# Altium project EmSys_K70Wn_v1.PrjPCB (part 2 of 3)

## Sheet Sheet3.SchDoc
size A3; DocumentNumber: 3; SheetNumber: 3; SheetTotal: 7
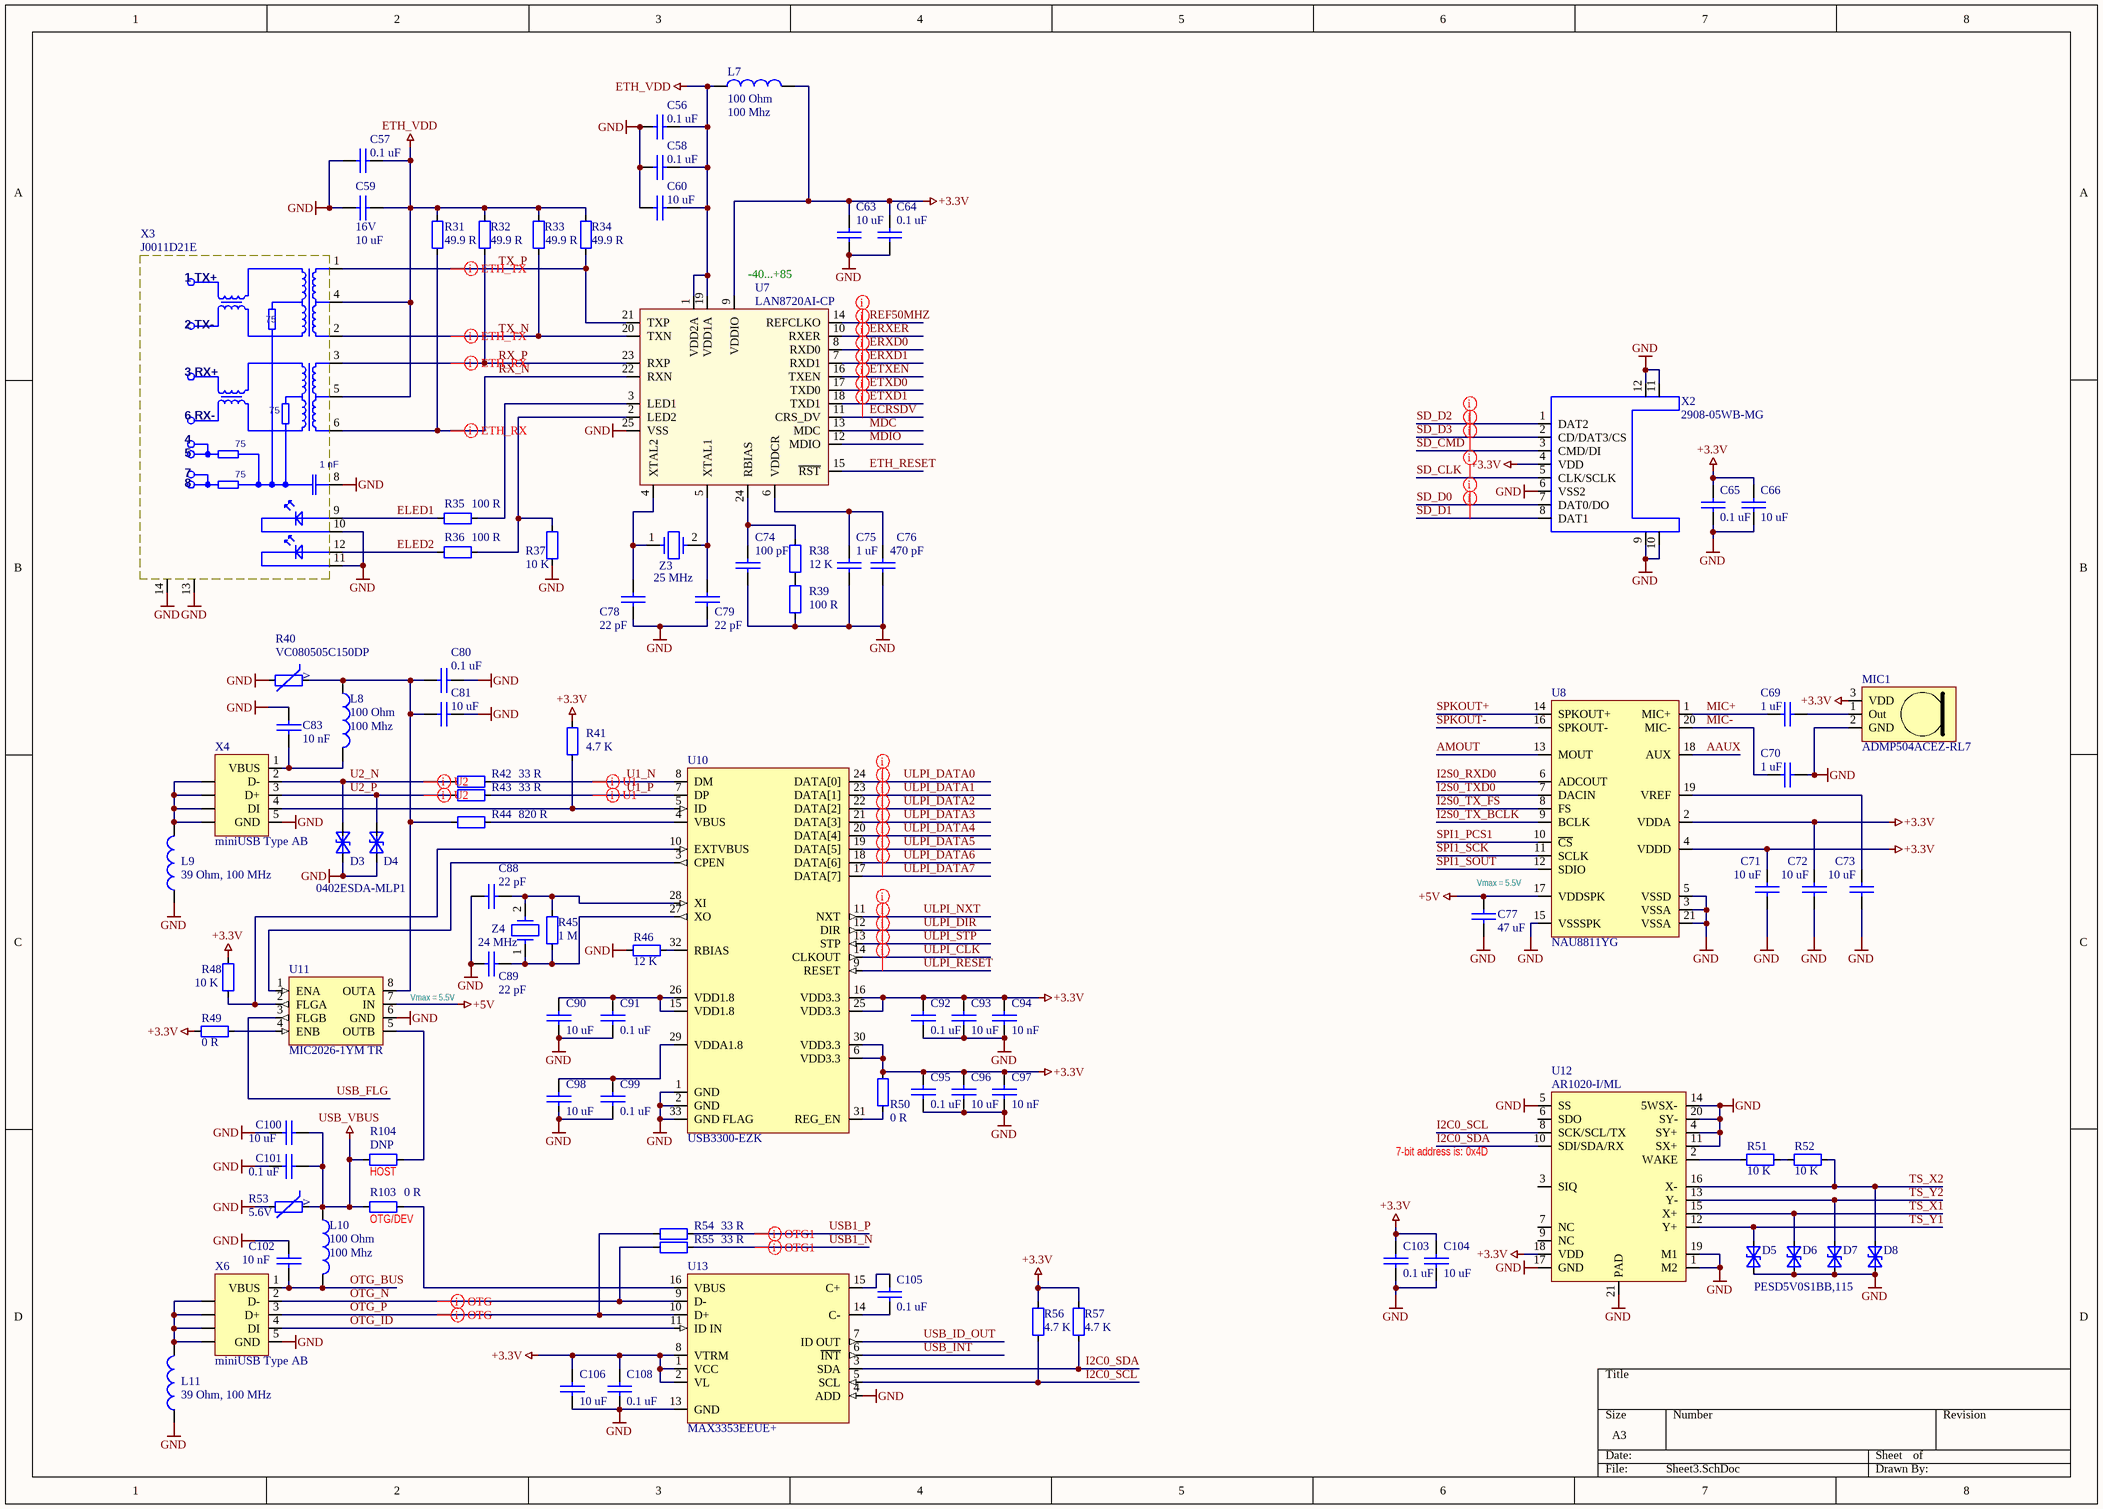
[diagram p2: Sheet3.SchDoc]

### Parts
C56  value 0.1 uF  [1608[0603]]  (hidden comment: CL10B104KA8NNND)
C57  value 0.1 uF  [1608[0603]]  (hidden comment: CL10B104KA8NNND)
C58  value 0.1 uF  [1608[0603]]  (hidden comment: CL10B104KA8NNND)
C59  value 10 uF  Voltage: 16V  [2012[0805]]  (hidden comment: C2012X5R1C106K085AC)
C60  value 10 uF  [2012[0805]]  (hidden comment: C2012X5R1C106K085AC)
C63  value 10 uF  [2012[0805]]  (hidden comment: C2012X5R1C106K085AC)
C64  value 0.1 uF  [1608[0603]]  (hidden comment: CL10B104KA8NNND)
C65  value 0.1 uF  [1608[0603]]  (hidden comment: CL10B104KA8NNND)
C66  value 10 uF  [2012[0805]]  (hidden comment: C2012X5R1C106K085AC)
C69  value 1 uF  [2012[0805]]  (hidden comment: GRM21BR71A105KA01L)
C70  value 1 uF  [2012[0805]]  (hidden comment: GRM21BR71A105KA01L)
C71  value 10 uF  [0805-1206]  (hidden comment: LMK212F106ZG-T)
C72  value 10 uF  [0805-1206]  (hidden comment: LMK212F106ZG-T)
C73  value 10 uF  [0805-1206]  (hidden comment: LMK212F106ZG-T)
C74  value 100 pF  [1608[0603]]  (hidden comment: CL10C101JB8NNNC)
C75  value 1 uF  [1608[0603]]  (hidden comment: CL10A105KO8NNNC)
C76  value 470 pF  [1608[0603]]  (hidden comment: CL10C471JB8NNNC)
C77  value 47 uF  [3225[1210]]  (hidden comment: GRM32ER71A476KE15L)
C78  value 22 pF  [1608[0603]]  (hidden comment: 0603N220J500CT)
C79  value 22 pF  [1608[0603]]  (hidden comment: 0603N220J500CT)
C80  value 0.1 uF  [1608[0603]]  (hidden comment: CL10B104KA8NNND)
C81  value 10 uF  [2012[0805]]  (hidden comment: C2012X5R1C106K085AC)
C83  value 10 nF  [1608[0603]]  (hidden comment: CL10B103JB8NNNC)
C88  value 22 pF  [1608[0603]]  (hidden comment: 0603N220J500CT)
C89  value 22 pF  [1608[0603]]  (hidden comment: 0603N220J500CT)
C90  value 10 uF  [2012[0805]]  (hidden comment: C2012X5R1C106K085AC)
C91  value 0.1 uF  [1608[0603]]  (hidden comment: CL10B104KA8NNND)
C92  value 0.1 uF  [1608[0603]]  (hidden comment: CL10B104KA8NNND)
C93  value 10 uF  [2012[0805]]  (hidden comment: C2012X5R1C106K085AC)
C94  value 10 nF  [1005[0402]]  (hidden comment: CL05B103KB5NNNC)
C95  value 0.1 uF  [1608[0603]]  (hidden comment: CL10B104KA8NNND)
C96  value 10 uF  [2012[0805]]  (hidden comment: C2012X5R1C106K085AC)
C97  value 10 nF  [1005[0402]]  (hidden comment: CL05B103KB5NNNC)
C98  value 10 uF  [2012[0805]]  (hidden comment: C2012X5R1C106K085AC)
C99  value 0.1 uF  [1608[0603]]  (hidden comment: CL10B104KA8NNND)
C100  value 10 uF  [2012[0805]]  (hidden comment: C2012X5R1C106K085AC)
C101  value 0.1 uF  [1608[0603]]  (hidden comment: CL10B104KA8NNND)
C102  value 10 nF  [1608[0603]]  (hidden comment: CL10B103JB8NNNC)
C103  value 0.1 uF  [1608[0603]]  (hidden comment: CL10B104KA8NNND)
C104  value 10 uF  [2012[0805]]  (hidden comment: C2012X5R1C106K085AC)
C105  value 0.1 uF  [1608[0603]]  (hidden comment: CL10B104KA8NNND)
C106  value 10 uF  [2012[0805]]  (hidden comment: C2012X5R1C106K085AC)
C108  value 0.1 uF  [1608[0603]]  (hidden comment: CL10B104KA8NNND)
D3  0402ESDA-MLP1  [0402]  (value not drawn)
D4  0402ESDA-MLP1  [0402]
D5  PESD5V0S1BB,115  [SOD523]
D6  PESD5V0S1BB,115  [SOD523]  (value not drawn)
D7  PESD5V0S1BB,115  [SOD523]  (value not drawn)
D8  PESD5V0S1BB,115  [SOD523]  (value not drawn)
L7  value 100 Ohm  Freq: 100 Mhz  [0603]  (hidden comment: MPZ1608D101B)
L8  value 100 Ohm  Freq: 100 Mhz  [0603]  (hidden comment: MPZ1608D101B)
L9  value 39 Ohm, 100 MHz  [0805]  (hidden comment: EXC-ML20A390U)
L10  value 100 Ohm  Freq: 100 Mhz  [0603]  (hidden comment: MPZ1608D101B)
L11  value 39 Ohm, 100 MHz  [0805]  (hidden comment: EXC-ML20A390U)
MIC1  ADMP504ACEZ-RL7  [ADMP504ACEZ]
R31  value 49.9 R  [0603]  (hidden comment: ERJ-3EKF49R9V)
R32  value 49.9 R  [0603]  (hidden comment: ERJ-3EKF49R9V)
R33  value 49.9 R  [0603]  (hidden comment: ERJ-3EKF49R9V)
R34  value 49.9 R  [0603]  (hidden comment: ERJ-3EKF49R9V)
R35  value 100 R  [0603]  (hidden comment: ERJ-3EKF1000V)
R36  value 100 R  [0603]  (hidden comment: ERJ-3EKF1000V)
R37  value 10 K  [0603]  (hidden comment: ERJ-3EKF1002V)
R38  value 12 K  [0603]  (hidden comment: RC0603FR-0712KL)
R39  value 100 R  [0603]  (hidden comment: ERJ-3EKF1000V)
R40  VC080505C150DP  [2012[0805]]
R41  value 4.7 K  [0603]  (hidden comment: RJ0603FRE074K7L)
R42  value 33 R  [0603]  (hidden comment: RC0603FR-0733RL)
R43  value 33 R  [0603]  (hidden comment: RC0603FR-0733RL)
R44  value 820 R  [0603]  (hidden comment: RC0603FR-07820RL)
R45  value 1 M  [0603]  (hidden comment: RC0603FR-071ML)
R46  value 12 K  [0603]  (hidden comment: RC0603FR-0712KL)
R48  value 10 K  [0603]  (hidden comment: ERJ-3EKF1002V)
R49  value 0 R  [0603]  (hidden comment: RC0603JR-070RL)
R50  value 0 R  [0603]  (hidden comment: RC0603JR-070RL)
R51  value 10 K  [0603]  (hidden comment: ERJ-3EKF1002V)
R52  value 10 K  [0603]  (hidden comment: ERJ-3EKF1002V)
R53  Voltage: 5.6V  [2012[0805]]  (hidden comment: VC080505C150DP)
R54  value 33 R  [0603]  (hidden comment: RC0603FR-0733RL)
R55  value 33 R  [0603]  (hidden comment: RC0603FR-0733RL)
R56  value 4.7 K  [0603]  (hidden comment: RJ0603FRE074K7L)
R57  value 4.7 K  [0603]  (hidden comment: RJ0603FRE074K7L)
R103  value 0 R  [0603]  (hidden comment: RC0603JR-070RL)
R104  value DNP  [0603]  (hidden comment: DNP_0603)  (no BOM)
U7  LAN8720AI-CP  [THIN QFN 24]
U8  NAU8811YG  [THIN QFN 20 W/O VIA]
U10  USB3300-EZK  [HVQFN32 NXP]
U11  MIC2026-1YM TR  [SO-8]
U12  AR1020-I/ML  [THIN QFN 20 W/O VIA]
U13  MAX3353EEUE+  [TSOP65P640-16AM]
X2  2908-05WB-MG  [2908-05WB-MG]
X3  J0011D21E  [PulseJack_J00]
X4  miniUSB Type AB  [USB AB 56579-0576 Molex]
X6  miniUSB Type AB  [USB AB 56579-0576 Molex]
Z3  value 25 MHz  [ABM3]  (hidden comment: ABM3-25.000MHZ-B2-T)
Z4  value 24 MHz  [ABM3]  (hidden comment: ABM3-24.000MHZ-B2-T)

### Nets
+3.3V: C63.2 C64.2 C65.1 C66.1 C71.2 C72.2 C92.2 C93.1 C94.2 C95.2 C96.1 C97.2 C103.1 C104.1 C106.2 C108.1 L7.2 MIC1.3(VDD) R41.2 R48.1 R49.2 R50.2 R56.2 R57.2 U7.9(VDDIO) U8.2(VDDA) U8.4(VDDD) U10.6(VDD3.3) U10.16(VDD3.3) U10.25(VDD3.3) U10.30(VDD3.3) U12.18(VDD) U13.1(VCC) U13.2(VL) U13.8(VTRM) X2.4(VDD)
+5V: C77.1 U8.17(VDDSPK) U11.7(IN)
ETH_VDD: C56.1 C57.1 C58.1 C59.1 C60.1 L7.1 R31.2 R32.2 R33.1 R34.1 U7.1(VDD2A) U7.19(VDD1A) X3.4(CT) X3.5(CT)
GND: C56.2 C57.2 C58.2 C59.2 C60.2 C63.1 C64.1 C65.2 C66.2 C70.2 C71.1 C72.1 C73.1 C74.2 C75.1 C76.2 C77.2 C78.2 C79.2 C80.2 C81.1 C83.2 C88.1 C89.1 C90.1 C91.2 C92.1 C93.2 C94.1 C95.1 C96.2 C97.1 C98.1 C99.2 C100.1 C101.2 C102.2 C103.2 C104.2 C106.1 C108.2 D3.1(C) D4.1(C) D5.2(A) D6.2(A) D7.2(A) D8.2(A) L9.1 L11.1 MIC1.2(GND) R37.2 R39.1 R40.1 R46.1 R53.1 U7.25(VSS) U8.3(VSSA) U8.5(VSSD) U8.15(VSSSPK) U8.21(VSSA) U10.1(GND) U10.2(GND) U10.33(GND_FLAG) U11.6(GND) U12.1(M2) U12.4(SY+) U12.5(SS) U12.11(SX+) U12.14(5WSX-) U12.17(GND) U12.19(M1) U12.20(SY-) U12.21(PAD) U13.4(ADD) U13.13(GND) X2.6(VSS2) X2.9 X2.10(WP) X2.11(GND) X2.12(GND) X3.8(GND) X3.10 X3.11 X3.13 X3.14 X4.5(GND) X6.5(GND)
USB_VBUS: C100.2 C101.1 L10.1 R53.2 R103.2 R104.1
AAUX: U8.18(AUX)
AMOUT: U8.13(MOUT)
ECRSDV: U7.11(CRS_DV)
ELED1: R35.1 X3.9
ELED2: R36.1 X3.12
ERXD0: U7.8(RXD0)
ERXD1: U7.7(RXD1)
ERXER: U7.10(RXER)
ETH_RESET: U7.15(~{RST})
ETXD0: U7.17(TXD0)
ETXD1: U7.18(TXD1)
ETXEN: U7.16(TXEN)
I2C0_SCL: R56.1 U12.8(SCK/SCL/TX) U13.5(SCL)
I2C0_SDA: R57.1 U12.10(SDI/SDA/RX) U13.3(SDA)
I2S0_RXD0: U8.6(ADCOUT)
I2S0_TX_BCLK: U8.9(BCLK)
I2S0_TX_FS: U8.8(FS)
I2S0_TXD0: U8.7(DACIN)
MDC: U7.13(MDC)
MDIO: U7.12(MDIO)
MIC+: C69.1 U8.1(MIC+)
MIC-: C70.1 U8.20(MIC-)
OTG_BUS: C102.1 L10.2 X6.1(VBUS)
OTG_ID: U13.11(ID_IN) X6.4(DI)
OTG_N: R55.1 U13.9(D-) X6.2(D-)
OTG_P: R54.1 U13.10(D+) X6.3(D+)
REF50MHZ: U7.14(REFCLKO)
RX_N: R31.1 U7.22(RXN) X3.6(RD-)
RX_P: R32.1 U7.23(RXP) X3.3(RD+)
SD_CLK: X2.5(CLK/SCLK)
SD_CMD: X2.3(CMD/DI)
SD_D0: X2.7(DAT0/DO)
SD_D1: X2.8(DAT1)
SD_D2: X2.1(DAT2)
SD_D3: X2.2(CD/DAT3/CS)
SPI1_PCS1: U8.10(~{CS})
SPI1_SCK: U8.11(SCLK)
SPI1_SOUT: U8.12(SDIO)
SPKOUT+: U8.14(SPKOUT+)
SPKOUT-: U8.16(SPKOUT-)
TS_X1: D6.1(C) U12.15(X+)
TS_X2: D8.1(C) R52.2 U12.16(X-)
TS_Y1: D5.1(C) U12.12(Y+)
TS_Y2: D7.1(C) U12.13(Y-)
TX_N: R33.2 U7.20(TXN) X3.2(TD-)
TX_P: R34.2 U7.21(TXP) X3.1(TD+)
U1_N: R42.2 U10.8(DM)
U1_P: R43.2 U10.7(DP)
U2_N: D3.2(A) R42.1 X4.2(D-)
U2_P: D4.2(A) R43.1 X4.3(D+)
ULPI_CLK: U10.14(CLKOUT)
ULPI_DATA0: U10.24(DATA[0])
ULPI_DATA1: U10.23(DATA[1])
ULPI_DATA2: U10.22(DATA[2])
ULPI_DATA3: U10.21(DATA[3])
ULPI_DATA4: U10.20(DATA[4])
ULPI_DATA5: U10.19(DATA[5])
ULPI_DATA6: U10.18(DATA[6])
ULPI_DATA7: U10.17(DATA[7])
ULPI_DIR: U10.12(DIR)
ULPI_NXT: U10.11(NXT)
ULPI_RESET: U10.9(RESET)
ULPI_STP: U10.13(STP)
USB1_N: R55.2
USB1_P: R54.2
USB_FLG: U11.3(FLGB)
USB_ID_OUT: U13.7(ID_OUT)
USB_INT: U13.6(~{INT})
NetC69_2: C69.2 MIC1.1(Out)
NetC73_2: C73.2 U8.19(VREF)
NetC74_1: C74.1 R38.2 U7.24(RBIAS)
NetC75_2: C75.2 C76.1 U7.6(VDDCR)
NetC78_1: C78.1 U7.4(XTAL2) Z3.1
NetC79_1: C79.1 U7.5(XTAL1) Z3.2
NetC80_1: C80.1 C81.2 L8.1 R40.2 R44.1 U11.8(OUTA)
NetC83_1: C83.1 L8.2 X4.1(VBUS)
NetC88_2: C88.2 R45.2 U10.28(XI) Z4.2
NetC89_2: C89.2 R45.1 U10.27(XO) Z4.1
NetC90_2: C90.2 C91.1 U10.15(VDD1.8) U10.26(VDD1.8)
NetC98_2: C98.2 C99.1 U10.29(VDDA1.8)
NetC105_1: C105.1 U13.15(C+)
NetC105_2: C105.2 U13.14(C-)
NetL9_2: L9.2 X4.S1(SHLD) X4.S2(SHLD) X4.S3(SHLD) X4.S4(SHLD)
NetL11_2: L11.2 X6.S1(SHLD) X6.S2(SHLD) X6.S3(SHLD) X6.S4(SHLD)
NetR35_2: R35.2 U7.3(LED1)
NetR36_2: R36.2 R37.1 U7.2(LED2)
NetR38_1: R38.1 R39.2
NetR41_1: R41.1 U10.5(ID) X4.4(DI)
NetR44_2: R44.2 U10.4(VBUS)
NetR46_2: R46.2 U10.32(RBIAS)
NetR48_2: R48.2 U10.10(EXTVBUS) U11.2(FLGA)
NetR49_1: R49.1 U11.4(ENB)
NetR50_1: R50.1 U10.31(REG_EN)
NetR51_1: R51.1 U12.2(WAKE)
NetR51_2: R51.2 R52.1
NetR103_1: R103.1 U13.16(VBUS)
NetR104_2: R104.2 U11.5(OUTB)
NetU10_3: U10.3(CPEN) U11.1(ENA)

Not connected (* = marked no-connect by the designer): U12 3(SIQ) 6(SDO) 7(NC) 9(NC)

### Layout directives
net class ETHERNET: ECRSDV, ERXD0, ERXD1, ERXER, ETXD0, ETXD1, ETXEN, REF50MHZ
net class SD_CARD: SD_CLK, SD_CMD, SD_D0, SD_D1, SD_D2, SD_D3
net class ULPI_DATA: ULPI_DATA0, ULPI_DATA1, ULPI_DATA2, ULPI_DATA3, ULPI_DATA4, ULPI_DATA5, ULPI_DATA6, ULPI_DATA7
net class ULPI_CTRL: ULPI_CLK, ULPI_DIR, ULPI_NXT, ULPI_RESET, ULPI_STP
differential pair: OTG_N, OTG_P, RX_N, RX_P, TX_N, TX_P, U1_N, U1_P, U2_N, U2_P, USB1_N, USB1_P

### Notes on the sheet
- (near U7) -40...+85
- Vmax = 5.5V
- (near R104) HOST
- (near U12) 7-bit address is: 0x4D
- (near R103) OTG/DEV
- (in symbol J0011D21E) 1 TX+; 2 TX-; 75; 3 RX+; 6 RX-; 1 nF; 7
- (in symbol VC080505C150D) V

### Library data of the parts
C56-C58 C64 C65 C80 C91 C92 C95 C99 C101 C103 C105 C108 = CVNF100K0603-25: as C51 on sheet Sheet2; Tolerance: 10%; Distributor: Future; Price: 0.0026 Euro; Voltage: 25 V; PartNum: CL10B104KA8NNND; PartName: CL10B104KA8NNND; Price50: 0.0026 Euro; Price100: 0.0026 Euro; Price1000: 0.0026 Euro
C59 C60 C63 C66 C81 C90 C93 C96 C98 C100 C104 C106 = C2012X5R1C106K/0.85: 10 uF, 16V, X5R, ±10%, 0805; Manufacturer: TDK Corporation; Distributor: Future; Price: 0.0347 Euro; Tolerance: ±10%; PartNum: C2012X5R1C106K085AC; PartName: C2012X5R1C106K085AC; Price50: 0.0347 Euro; Price100: 0.0347 Euro; Price1000: 0.0347 Euro
  C60 C63 C66 C81 C90 C93 C96 C98 C100 C104 C106: Voltage: 16V
C69 C70 = GRM21BR71A105KA01L: 1 uF, 10V, 10%, X7R, 0805; Manufacturer: Murata; PartNum: 311-1458-1-ND; PartName: CC0805KKX7R6BB105; Tolerance: 10%; Price: 0.02$; Distributor: Mouser; Voltage: 10 V
C71-C73 = LMK212F106ZG-T: 10 uF, 10V, Y5V, -20%.. +80%, 0805; Manufacturer: Taiyo Yuden; PartNum: 587-1312-6-ND; Distributor: Digi-Key; Price: 0.11$; Tolerance: 20%.. +80%; Voltage: 10V; PartName: LMK212F106ZG-T
C74 = CCPF100K0603: 100 pF, 50V, 5%, NP0, 0603 SMD MLC Capacitor; Manufacturer: SAMSUNG; Tolerance: 5%; Price: 0.003$; Distributor: Future; PartNum: CL10C101JB8NNNC; Voltage: 50 V; PartName: CL10C101JB8NNNC; Price50: 0.003$; Price100: 0.003$; Price1000: 0.003$
C75 = GRM188R60J105KA01D: 1.0 uF, 16V, 10%, X5R, 0603; Manufacturer: SAMSUNG; Tolerance: 10%; Distributor: Future; Price: 0.0037 Euro; PartNum: CL10A105KO8NNNC; Voltage: 16 V; PartName: CL10A105KO8NNNC; Price50: 0.0037 Euro; Price100: 0.0037 Euro; Price1000: 0.0037 Euro
C76 = 06035A471JAT2A: 470 pF, 50V, 5%, C0G, NP0, -55°C ~ 125°C,0603 SMD MLC Capacitor; Manufacturer: SAMSUNG; Tolerance: 5%; Price: 0.003$; Distributor: Future; PartNum: CL10C471JB8NNNC; Voltage: 50 V; PartName: CL10C471JB8NNNC; Price50: 0.003$; Price100: 0.003$; Price1000: 0.003$
C77 = GRM32ER71A476KE15L: 47.0 uF, 10V, 10%, X7R, 1210; Manufacturer: Murata Electronics North America; PartNum: 490-5312-2-ND; Tolerance: 10%; Price: 3.3; Distributor: Digi-Key; Voltage: 10V; PartName: GRM32ER71A476KE15L
C78 C79 C88 C89 = CCPF022K0603: 22 pF, 50V, 5%, NP0, 0603 SMD MLC Capacitor; Manufacturer: WLS; Tolerance: 5%; Price: 0.0017$; Distributor: Future; PartNum: 0603N220J500CT; Voltage: 50 V; PartName: 0603N220J500CT; Price50: 0.0017$; Price100: 0.0017$; Price1000: 0.0017$
C83 C102 = CVNF010K0603: 10 nF, 50V, 5%, X7R, 0603 SMD MLC Capacitor; Manufacturer: SAMSUNG; Tolerance: 5%; Distributor: Future; Price: 0.0045 Euro; PartNum: CL10B103JB8NNNC; Voltage: 50 V; PartName: CL10B103JB8NNNC; Price50: 0.0045 Euro; Price100: 0.0045 Euro; Price1000: 0.0045 Euro
C94 C97 = GRM155R71C103KA01D: 10 nF, 16V, 10%, X7R, 0402; Manufacturer: SAMSUNG; Tolerance: 10%; Distributor: Future; Price: 0.02$; PartNum: CL05B103KB5NNNC; Voltage: 16 V; PartName: CL05B103KB5NNNC; Price50: 0.006$; Price100: 0.004$; Price1000: 0.003$
D3 D4 = 0402ESDA-MLP1: SUPPRESSOR ESD 30VDC 0402 HFREE; Manufacturer: Cooper Bussmann; PartNum: 283-2964-2-ND; Voltage: 30V; Distributor: Digi-Key; Price: 0.087$; PartName: 0402ESDA-MLP1
D5-D8 = PESD5V0S1BB,115: TVS DIODE 5VWM 14VC SOD523; Manufacturer: NXP Semiconductors; PartNum: 568-4054-2-ND; Voltage: 5V; Distributor: Digi-Key; Price: 0.1$; PartName: PESD5V0S1BB,115
L7 L8 L10 = MPZ1608D101B: FERRITE CHIP 100 OHM 1A 0603; Manufacturer: TDK Corporation; PartNum: 445-2988-2-ND; Distributor: Digi-Key; Price: 0.02$; PartName: MPZ1608D101B
L9 L11 = EXC-ML20A390U: Ferrite bead, 39 Ohm, 100 MHz,  4 A; Manufacturer: Panasonic - ECG; PartNum: P10191TR-ND; Ordered: Digi-Key; Distributor: Digi-Key; Price: 0.21$; PartName: EXC-ML20A390U; Price50: 0.17$; Price100: 0.15$; Price1000: 0.1$
MIC1 = ADMP504ACEZ-RL7: Mems Omni  -38dB ,  100Hz-20kHz, 200Ohm, 2 V, 65dB s/n, 225 uA; Manufacturer: Analog Devices Inc; PartNum: ADMP504ACEZ-RL7CT-ND; Distributor: DigiKey; Price: 4.52$; PartName: ADMP504ACEZ-RL7CT-ND
R31-R34 = CRCW060349R9FKEA: 49.9 R, 1%, 0.1 W, 0603, SMD Resistor, Taped; Manufacturer: PANASONIC; Voltage: 75 V; Distributor: Future; Price: 0.0015 Euro; Tolerance: 1%; PartNum: ERJ-3EKF49R9V; PartName: ERJ-3EKF49R9V; Price50: 0.0015 Euro; Price100: 0.0015 Euro; Price1000: 0.0015 Euro
R35 R36 R39 = RL0603E100-1: 100 R, 1%, 0603, SMD Resistor, Taped; Manufacturer: PANASONIC; Voltage: 75 V; Distributor: Future; Price: 0.0017$; Tolerance: 1%; PartNum: ERJ-3EKF1000V; PartName: ERJ-3EKF1000V; Price50: 0.0015 Euro; Price100: 0.0015 Euro; Price1000: 0.0015 Euro
R37 R48 R51 R52 = RL0603K010-1: as R21 on sheet Sheet2; Distributor: Future; Price: 0.0015 Euro; Tolerance: 1%; PartNum: ERJ-3EKF1002V; PartName: ERJ-3EKF1002V; Price50: 0.0015 Euro; Price100: 0.0015 Euro; Price1000: 0.0015 Euro
R38 = RL0603K012-1: 12 K, 1%, 0603, SMD Resistor, Taped; Manufacturer: YAGEO AMERICA CORPORATION; Voltage: 75 V; Distributor: Farnell; Price: 0.0017$; Tolerance: 1%; PartNum: RC0603FR-0712KL; PartName: RC0603FR-0712KL; Price50: 0.0017$; Price100: 0.0017$; Price1000: 0.0017$
R40 = VC080505C150D: TVS, volt 5.6 V, Clamping voltage 18 V; Manufacturer: AVX Corporation; PartNum: 478-2507-1-ND; Voltage: 5.6V; Ordered: Digi-Key; Price: 0.81$; Distributor: Digi-Key; PartName: VC080505C150DP; Price50: 0.4$; Price100: 0.47$; Price1000: 0.38$
R41 R56 R57 = RL0603K004.7-1_1: 4.7 K, 1%, 0603, SMD Resistor, Taped; Manufacturer: YAGEO AMERICA CORPORATION; Voltage: 75 V; Distributor: Future; Price: 0.0017$; Tolerance: 1%; PartNum: RJ0603FRE074K7L; PartName: RJ0603FRE074K7L; Price50: 0.0017$; Price100: 0.0017$; Price1000: 0.0017$
R42 R43 R54 R55 = RL0603E033-1: 33 R, 1%, 0603, SMD Resistor, Taped; Manufacturer: YAGEO AMERICA CORPORATION; Voltage: 75 V; Distributor: Future; Price: 0.0017$; Tolerance: 1%; PartNum: RC0603FR-0733RL; PartName: RC0603FR-0733RL; Price50: 0.0017$; Price100: 0.0017$; Price1000: 0.0017$
R44 = RC0603FR-07820RL: 820 R, 1%, 0603, SMD Resistor, Taped; Manufacturer: YAGEO AMERICA CORPORATION; PartNum: 311-820HRTR-ND; Voltage: 75 V; Distributor: Digi-Key; Price: 0.0017$; Tolerance: 1%; PartName: RC0603FR-07820RL; Price50: 0.0017$; Price100: 0.0017$; Price1000: 0.0017$
R45 = RC0603FR-071ML: as R1 on sheet Sheet1; Distributor: Future; Price: 0.002 Euro; Tolerance: 1%; PartNum: RC0603FR-071ML; PartName: RC0603FR-071ML
R46 = RL0603K012-1_1: 12 K, 1%, 0603, SMD Resistor, Taped; Manufacturer: YAGEO AMERICA CORPORATION; Voltage: 75 V; Distributor: Farnell; Price: 0.0017$; Tolerance: 1%; PartNum: RC0603FR-0712KL; PartName: RC0603FR-0712KL; Price50: 0.0017$; Price100: 0.0017$; Price1000: 0.0017$
R49 R50 R103 = RL0603E000: as R20 on sheet Sheet2; Distributor: Future; Price: 0.0017$; Tolerance: 5%; PartNum: RC0603JR-070RL; PartName: RC0603JR-070RL; Price50: 0.0017$; Price100: 0.0017$; Price1000: 0.0017$
R53 = VC080505C150D: TVS, volt 5.6 V, Clamping voltage 18 V; Manufacturer: AVX Corporation; PartNum: 478-2507-1-ND; Ordered: Digi-Key; Price: 0.81$; Distributor: Digi-Key; PartName: VC080505C150DP; Price50: 0.4$; Price100: 0.47$; Price1000: 0.38$
R104 = DNP_0603: DNP, 0603
U7 = LAN8720AI-CP: TXRX PHY 10/100 1.6...3.6V, -40..85 C, 24-QFN; Manufacturer: Micrel Inc; PartNum: 886-LAN8720AI-CP; Ordered: Mouser; Distributor: Mouser; Price: 1.34 Euro; PartName: LAN8720AI-CP; Price50: 1.25 Euro; Price100: 0.98 Euro; Price1000: 0.86 Euro
U8 = NAU8811YG: Audio CODEC, Mono, Speaker Driver, QFN-20; Manufacturer: Nuvoton Technology; PartNum: NAU8811YG-ND; Distributor: Digi-Key; Price: 2.4$; PartName: NAU8811YG
U10 = USB3300-EZK: IC USB HOST/OTG PHY ULPI 32-QFN; Manufacturer: Microchip Technology; PartNum: 638-1034-ND; Distributor: DigiKey; Price: 1.24$; PartName: USB3300-EZK
U11 = MIC2026-1YM TR: Dual-Channel Power Distribution Switch, 8 Lead SOIC; Manufacturer: Micrel; PartNum: 576-1059-1-ND; Ordered: Future; Price: 0.59 Euro; Distributor: Future; PartName: MIC2026-1YM TR; Price50: 0.57 Euro; Price100: 0.76$; Price1000: 0.53$
U12 = AR1020-I/ML: IC TOUCH SCREEN CTRLR 20-QFN; Manufacturer: Microchip Technology; PartNum: AR1020-I/ML-ND; Distributor: DigiKey; Price: 2.3$; PartName: AR1020-I/ML
U13 = MAX3353EEUE+: IC CHARGE PUMP USB OTG 16TSSOP; Manufacturer: Maxim Integrated; PartNum: MAX3353EEUE+-ND; Distributor: DigiKey; Price: 2.82$; PartName: MAX3353EEUE+
X2 = 2908-05WB-MG: microSD cadr holder; Manufacturer: Amphenol Commercial Products; PartNum: 101-00660-68-6-1-ND; PartName: 101-00660-68-6; Ordered: Digi-Key; Price: 1.97$; Distributor: Digi-Key; Price50: 1.44$; Price100: 1.29$; Price1000: 1.06$
X3 = J0011D21E: 10/100 Base-TX RJ45 1x1 with LEDs 8-pin (J0 series); Manufacturer: Pulse; PartNum: 673-J0011D21E; Price: 3.74 $; Distributor: Mouser
X4 X6 = USB AB 56579-0576: SMD USB - OTG, miniUSB Type AB; Manufacturer: Molex/Waldom Electronics Corp; PartNum: WM17122CT-ND; Ordered: Digi-Key; Distributor: Digi-Key; Price: 2.81$; PartName: miniUSB Type AB; Price50: 2.43$; Price100: 1.83$; Price1000: 1.62$
Z3 = ABM3-25.000MHZ-B2-T: 25 MHz, 18 pF, 30 Ohm, ±50ppm, -20°C ~ 70°C; Manufacturer: Abracon Corporation; PartNum: 535-9108-1-ND; Price: 1$; Distributor: Digi-Key; Tolerance: 50 ppm; PartName: ABM3-25.000MHZ-B2-T
Z4 = ABM3-24.000MHZ-B2-T: 24 MHz, 18 pF, 30 Ohm, ±50ppm, -20°C ~ 70°C; Manufacturer: Abracon Corporation; PartNum: 535-9106-1-ND; Price: 1$; Distributor: Digi-Key; Tolerance: 50 ppm; PartName: ABM3-24.000MHZ-B2-T

## Sheet Sheet4.SchDoc
size A3; DocumentNumber: 4; SheetNumber: 4; SheetTotal: 7
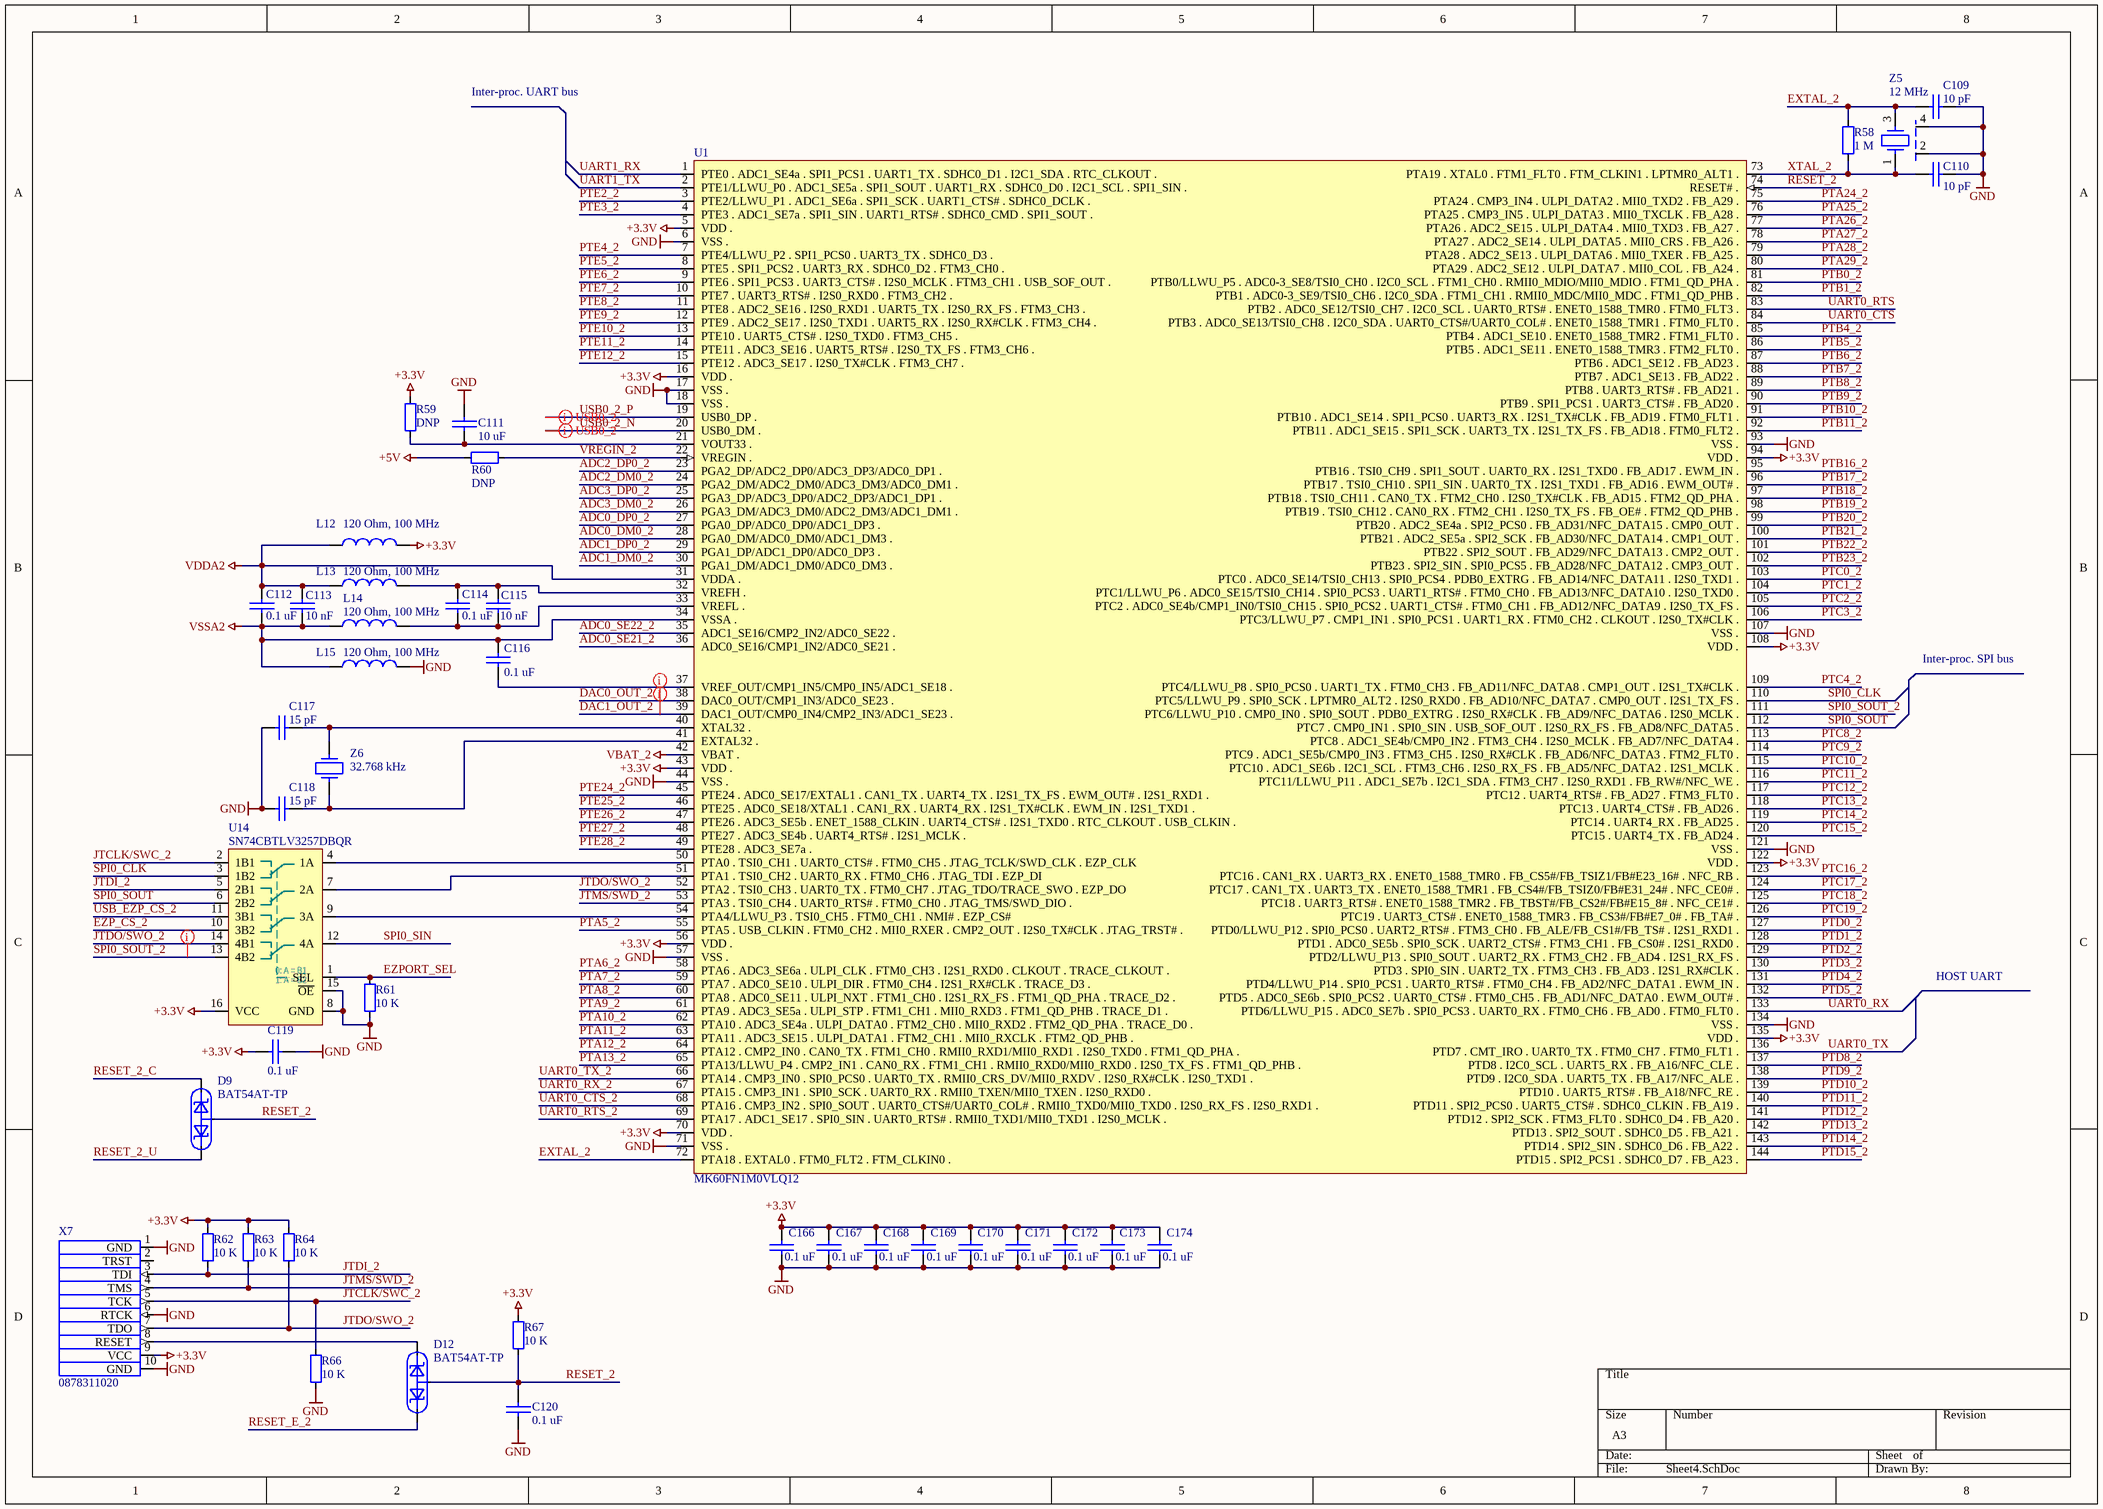
[diagram p3: Sheet4.SchDoc]

### Parts
C109  value 10 pF  [1608[0603]]  (hidden comment: CCPF010K0603)
C110  value 10 pF  [1608[0603]]  (hidden comment: CCPF010K0603)
C111  value 10 uF  [2012[0805]]  (hidden comment: C2012X5R1C106K085AC)
C112  value 0.1 uF  [1005[0402]]  (hidden comment: CL10B104KA8NNND)
C113  value 10 nF  [1005[0402]]  (hidden comment: CL05B103KB5NNNC)
C114  value 0.1 uF  [1005[0402]]  (hidden comment: CL10B104KA8NNND)
C115  value 10 nF  [1005[0402]]  (hidden comment: CL05B103KB5NNNC)
C116  value 0.1 uF  [1608[0603]]  (hidden comment: CL10B104KA8NNND)
C117  value 15 pF  [1608[0603]]  (hidden comment: CC0603JRNPO9BN150)
C118  value 15 pF  [1608[0603]]  (hidden comment: CC0603JRNPO9BN150)
C119  value 0.1 uF  [1005[0402]]  (hidden comment: CL10B104KA8NNND)
C120  value 0.1 uF  [1005[0402]]  (hidden comment: CL10B104KA8NNND)
C166  value 0.1 uF  [1005[0402]]  (hidden comment: CL10B104KA8NNND)
C167  value 0.1 uF  [1005[0402]]  (hidden comment: CL10B104KA8NNND)
C168  value 0.1 uF  [1005[0402]]  (hidden comment: CL10B104KA8NNND)
C169  value 0.1 uF  [1005[0402]]  (hidden comment: CL10B104KA8NNND)
C170  value 0.1 uF  [1005[0402]]  (hidden comment: CL10B104KA8NNND)
C171  value 0.1 uF  [1005[0402]]  (hidden comment: CL10B104KA8NNND)
C172  value 0.1 uF  [1005[0402]]  (hidden comment: CL10B104KA8NNND)
C173  value 0.1 uF  [1005[0402]]  (hidden comment: CL10B104KA8NNND)
C174  value 0.1 uF  [1005[0402]]  (hidden comment: CL10B104KA8NNND)
D9  BAT54AT-TP  [SOT-523F]
D12  BAT54AT-TP  [SOT-523F]
L12  value 120 Ohm, 100 MHz  [1005[0402]]  (hidden comment: MPZ1005S121C)
L13  value 120 Ohm, 100 MHz  [1005[0402]]  (hidden comment: MPZ1005S121C)
L14  value 120 Ohm, 100 MHz  [1005[0402]]  (hidden comment: MPZ1005S121C)
L15  value 120 Ohm, 100 MHz  [1005[0402]]  (hidden comment: MPZ1005S121C)
R58  value 1 M  [0603]  (hidden comment: RC0603FR-071ML)
R59  value DNP  [0603]  (hidden comment: DNP_0603)  (no BOM)
R60  value DNP  [0603]  (hidden comment: DNP_0603)  (no BOM)
R61  value 10 K  [0402]  (hidden comment: ERJ-3EKF1002V)
R62  value 10 K  [0402]  (hidden comment: ERJ-3EKF1002V)
R63  value 10 K  [0402]  (hidden comment: ERJ-3EKF1002V)
R64  value 10 K  [0402]  (hidden comment: ERJ-3EKF1002V)
R66  value 10 K  [0402]  (hidden comment: ERJ-3EKF1002V)
R67  value 10 K  [0402]  (hidden comment: ERJ-3EKF1002V)
U1  MK60FN1M0VLQ12  [LQFP144]
U14  SN74CBTLV3257DBQR  [TI DBQ 16pin (R-PDSO-G16)]
X7  0878311020  [878311020 MGRID WALL HDR SMD]
Z5  value 12 MHz  [DSX321G]  (hidden comment: NX3225SA-12.000MHZ-STD-CSR-1)
Z6  value 32.768 kHz  [ABS10]  (hidden comment: CM200C32768DZBT)

### Nets
+3.3V: C119.1 C166.2 C167.2 C168.2 C169.2 C170.2 C171.2 C172.2 C173.2 C174.2 L12.2 R59.1 R62.1 R63.1 R64.1 R67.1 U1.5(VDD_.) U1.16(VDD_.) U1.43(VDD_.) U1.56(VDD_.) U1.70(VDD_.) U1.94(VDD_.) U1.108(VDD_.) U1.122(VDD_.) U1.135(VDD_.) U14.16(VCC) X7.9(VCC)
+5V: R60.1
GND: C109.2 C110.2 C111.2 C117.2 C118.2 C119.2 C120.2 C166.1 C167.1 C168.1 C169.1 C170.1 C171.1 C172.1 C173.1 C174.1 L15.2 R61.2 R66.2 U1.6(VSS_.) U1.17(VSS_.) U1.18(VSS_.) U1.44(VSS_.) U1.57(VSS_.) U1.71(VSS_.) U1.93(VSS_.) U1.107(VSS_.) U1.121(VSS_.) U1.134(VSS_.) U14.8(GND) U14.15(~{OE}) X7.1(GND) X7.6(RTCK) X7.10(GND) Z5.2 Z5.4
VBAT_2: U1.42(VBAT_.)
VDDA2: C112.2 C113.1 L12.1 L13.1 U1.31(VDDA_.)
VSSA2: C112.1 C113.2 C116.2 L14.1 L15.1 U1.34(VSSA_.)
ADC0_DM0_2: U1.28(PGA0_DM/ADC0_DM0/ADC1_DM3_.)
ADC0_DP0_2: U1.27(PGA0_DP/ADC0_DP0/ADC1_DP3_.)
ADC0_SE21_2: U1.36(ADC0_SE16/CMP1_IN2/ADC0_SE21_.)
ADC0_SE22_2: U1.35(ADC1_SE16/CMP2_IN2/ADC0_SE22_.)
ADC1_DM0_2: U1.30(PGA1_DM/ADC1_DM0/ADC0_DM3_.)
ADC1_DP0_2: U1.29(PGA1_DP/ADC1_DP0/ADC0_DP3_.)
ADC2_DM0_2: U1.24(PGA2_DM/ADC2_DM0/ADC3_DM3/ADC0_DM1_.)
ADC2_DP0_2: U1.23(PGA2_DP/ADC2_DP0/ADC3_DP3/ADC0_DP1_.)
ADC3_DM0_2: U1.26(PGA3_DM/ADC3_DM0/ADC2_DM3/ADC1_DM1_.)
ADC3_DP0_2: U1.25(PGA3_DP/ADC3_DP0/ADC2_DP3/ADC1_DP1_.)
DAC0_OUT_2: U1.38(DAC0_OUT/CMP1_IN3/ADC0_SE23_.)
DAC1_OUT_2: U1.39(DAC1_OUT/CMP0_IN4/CMP2_IN3/ADC1_SE23_.)
EXTAL_2: C109.1 R58.2 U1.72(PTA18_._EXTAL0_._FTM0_FLT2_._FTM_CLKIN0_.) Z5.3
EZP_CS_2: U14.10(3B2)
EZPORT_SEL: R61.1 U14.1(SEL)
JTCLK/SWC_2: R66.1 U14.2(1B1) X7.5(TCK)
JTDI_2: R62.2 U14.5(2B1) X7.3(TDI)
JTDO/SWO_2: R64.2 U1.52(PTA2_._TSI0_CH3_._UART0_TX_._FTM0_CH7_._JTAG_TDO/TRACE_SWO_._EZP_DO) U14.14(4B1) X7.7(TDO)
JTMS/SWD_2: R63.2 U1.53(PTA3_._TSI0_CH4_._UART0_RTS#_._FTM0_CH0_._JTAG_TMS/SWD_DIO_.) X7.4(TMS)
PTA5_2: U1.55(PTA5_._USB_CLKIN_._FTM0_CH2_._MII0_RXER_._CMP2_OUT_._I2S0_TX#CLK_._JTAG_TRST#_.)
PTA6_2: U1.58(PTA6_._ADC3_SE6a_._ULPI_CLK_._FTM0_CH3_._I2S1_RXD0_._CLKOUT_._TRACE_CLKOUT_.)
PTA7_2: U1.59(PTA7_._ADC0_SE10_._ULPI_DIR_._FTM0_CH4_._I2S1_RX#CLK_._TRACE_D3_.)
PTA8_2: U1.60(PTA8_._ADC0_SE11_._ULPI_NXT_._FTM1_CH0_._I2S1_RX_FS_._FTM1_QD_PHA_._TRACE_D2_.)
PTA9_2: U1.61(PTA9_._ADC3_SE5a_._ULPI_STP_._FTM1_CH1_._MII0_RXD3_._FTM1_QD_PHB_._TRACE_D1_.)
PTA10_2: U1.62(PTA10_._ADC3_SE4a_._ULPI_DATA0_._FTM2_CH0_._MII0_RXD2_._FTM2_QD_PHA_._TRACE_D0_.)
PTA11_2: U1.63(PTA11_._ADC3_SE15_._ULPI_DATA1_._FTM2_CH1_._MII0_RXCLK_._FTM2_QD_PHB_.)
PTA12_2: U1.64(PTA12_._CMP2_IN0_._CAN0_TX_._FTM1_CH0_._RMII0_RXD1/MII0_RXD1_._I2S0_TXD0_._FTM1_QD_PHA_.)
PTA13_2: U1.65(PTA13/LLWU_P4_._CMP2_IN1_._CAN0_RX_._FTM1_CH1_._RMII0_RXD0/MII0_RXD0_._I2S0_TX_FS_._FTM1_QD_PHB_.)
PTA24_2: U1.75(PTA24_._CMP3_IN4_._ULPI_DATA2_._MII0_TXD2_._FB_A29_.)
PTA25_2: U1.76(PTA25_._CMP3_IN5_._ULPI_DATA3_._MII0_TXCLK_._FB_A28_.)
PTA26_2: U1.77(PTA26_._ADC2_SE15_._ULPI_DATA4_._MII0_TXD3_._FB_A27_.)
PTA27_2: U1.78(PTA27_._ADC2_SE14_._ULPI_DATA5_._MII0_CRS_._FB_A26_.)
PTA28_2: U1.79(PTA28_._ADC2_SE13_._ULPI_DATA6_._MII0_TXER_._FB_A25_.)
PTA29_2: U1.80(PTA29_._ADC2_SE12_._ULPI_DATA7_._MII0_COL_._FB_A24_.)
PTB0_2: U1.81(PTB0/LLWU_P5_._ADC0-3_SE8/TSI0_CH0_._I2C0_SCL_._FTM1_CH0_._RMII0_MDIO/MII0_MDIO_._FTM1_QD_PHA_.)
PTB1_2: U1.82(PTB1_._ADC0-3_SE9/TSI0_CH6_._I2C0_SDA_._FTM1_CH1_._RMII0_MDC/MII0_MDC_._FTM1_QD_PHB_.)
PTB4_2: U1.85(PTB4_._ADC1_SE10_._ENET0_1588_TMR2_._FTM1_FLT0_.)
PTB5_2: U1.86(PTB5_._ADC1_SE11_._ENET0_1588_TMR3_._FTM2_FLT0_.)
PTB6_2: U1.87(PTB6_._ADC1_SE12_._FB_AD23_.)
PTB7_2: U1.88(PTB7_._ADC1_SE13_._FB_AD22_.)
PTB8_2: U1.89(PTB8_._UART3_RTS#_._FB_AD21_.)
PTB9_2: U1.90(PTB9_._SPI1_PCS1_._UART3_CTS#_._FB_AD20_.)
PTB10_2: U1.91(PTB10_._ADC1_SE14_._SPI1_PCS0_._UART3_RX_._I2S1_TX#CLK_._FB_AD19_._FTM0_FLT1_.)
PTB11_2: U1.92(PTB11_._ADC1_SE15_._SPI1_SCK_._UART3_TX_._I2S1_TX_FS_._FB_AD18_._FTM0_FLT2_.)
PTB16_2: U1.95(PTB16_._TSI0_CH9_._SPI1_SOUT_._UART0_RX_._I2S1_TXD0_._FB_AD17_._EWM_IN_.)
PTB17_2: U1.96(PTB17_._TSI0_CH10_._SPI1_SIN_._UART0_TX_._I2S1_TXD1_._FB_AD16_._EWM_OUT#_.)
PTB18_2: U1.97(PTB18_._TSI0_CH11_._CAN0_TX_._FTM2_CH0_._I2S0_TX#CLK_._FB_AD15_._FTM2_QD_PHA_.)
PTB19_2: U1.98(PTB19_._TSI0_CH12_._CAN0_RX_._FTM2_CH1_._I2S0_TX_FS_._FB_OE#_._FTM2_QD_PHB_.)
PTB20_2: U1.99(PTB20_._ADC2_SE4a_._SPI2_PCS0_._FB_AD31/NFC_DATA15_._CMP0_OUT_.)
PTB21_2: U1.100(PTB21_._ADC2_SE5a_._SPI2_SCK_._FB_AD30/NFC_DATA14_._CMP1_OUT_.)
PTB22_2: U1.101(PTB22_._SPI2_SOUT_._FB_AD29/NFC_DATA13_._CMP2_OUT_.)
PTB23_2: U1.102(PTB23_._SPI2_SIN_._SPI0_PCS5_._FB_AD28/NFC_DATA12_._CMP3_OUT_.)
PTC0_2: U1.103(PTC0_._ADC0_SE14/TSI0_CH13_._SPI0_PCS4_._PDB0_EXTRG_._FB_AD14/NFC_DATA11_._I2S0_TXD1_.)
PTC1_2: U1.104(PTC1/LLWU_P6_._ADC0_SE15/TSI0_CH14_._SPI0_PCS3_._UART1_RTS#_._FTM0_CH0_._FB_AD13/NFC_DATA10_._I2S0_TXD0_.)
PTC2_2: U1.105(PTC2_._ADC0_SE4b/CMP1_IN0/TSI0_CH15_._SPI0_PCS2_._UART1_CTS#_._FTM0_CH1_._FB_AD12/NFC_DATA9_._I2S0_TX_FS_.)
PTC3_2: U1.106(PTC3/LLWU_P7_._CMP1_IN1_._SPI0_PCS1_._UART1_RX_._FTM0_CH2_._CLKOUT_._I2S0_TX#CLK_.)
PTC4_2: U1.109(PTC4/LLWU_P8_._SPI0_PCS0_._UART1_TX_._FTM0_CH3_._FB_AD11/NFC_DATA8_._CMP1_OUT_._I2S1_TX#CLK_.)
PTC8_2: U1.113(PTC8_._ADC1_SE4b/CMP0_IN2_._FTM3_CH4_._I2S0_MCLK_._FB_AD7/NFC_DATA4_.)
PTC9_2: U1.114(PTC9_._ADC1_SE5b/CMP0_IN3_._FTM3_CH5_._I2S0_RX#CLK_._FB_AD6/NFC_DATA3_._FTM2_FLT0_.)
PTC10_2: U1.115(PTC10_._ADC1_SE6b_._I2C1_SCL_._FTM3_CH6_._I2S0_RX_FS_._FB_AD5/NFC_DATA2_._I2S1_MCLK_.)
PTC11_2: U1.116(PTC11/LLWU_P11_._ADC1_SE7b_._I2C1_SDA_._FTM3_CH7_._I2S0_RXD1_._FB_RW#/NFC_WE_.)
PTC12_2: U1.117(PTC12_._UART4_RTS#_._FB_AD27_._FTM3_FLT0_.)
PTC13_2: U1.118(PTC13_._UART4_CTS#_._FB_AD26_.)
PTC14_2: U1.119(PTC14_._UART4_RX_._FB_AD25_.)
PTC15_2: U1.120(PTC15_._UART4_TX_._FB_AD24_.)
PTC16_2: U1.123(PTC16_._CAN1_RX_._UART3_RX_._ENET0_1588_TMR0_._FB_CS5#/FB_TSIZ1/FB#E23_16#_._NFC_RB_.)
PTC17_2: U1.124(PTC17_._CAN1_TX_._UART3_TX_._ENET0_1588_TMR1_._FB_CS4#/FB_TSIZ0/FB#E31_24#_._NFC_CE0#_.)
PTC18_2: U1.125(PTC18_._UART3_RTS#_._ENET0_1588_TMR2_._FB_TBST#/FB_CS2#/FB#E15_8#_._NFC_CE1#_.)
PTC19_2: U1.126(PTC19_._UART3_CTS#_._ENET0_1588_TMR3_._FB_CS3#/FB#E7_0#_._FB_TA#_.)
PTD0_2: U1.127(PTD0/LLWU_P12_._SPI0_PCS0_._UART2_RTS#_._FTM3_CH0_._FB_ALE/FB_CS1#/FB_TS#_._I2S1_RXD1_.)
PTD1_2: U1.128(PTD1_._ADC0_SE5b_._SPI0_SCK_._UART2_CTS#_._FTM3_CH1_._FB_CS0#_._I2S1_RXD0_.)
PTD2_2: U1.129(PTD2/LLWU_P13_._SPI0_SOUT_._UART2_RX_._FTM3_CH2_._FB_AD4_._I2S1_RX_FS_.)
PTD3_2: U1.130(PTD3_._SPI0_SIN_._UART2_TX_._FTM3_CH3_._FB_AD3_._I2S1_RX#CLK_.)
PTD4_2: U1.131(PTD4/LLWU_P14_._SPI0_PCS1_._UART0_RTS#_._FTM0_CH4_._FB_AD2/NFC_DATA1_._EWM_IN_.)
PTD5_2: U1.132(PTD5_._ADC0_SE6b_._SPI0_PCS2_._UART0_CTS#_._FTM0_CH5_._FB_AD1/NFC_DATA0_._EWM_OUT#_.)
PTD8_2: U1.137(PTD8_._I2C0_SCL_._UART5_RX_._FB_A16/NFC_CLE_.)
PTD9_2: U1.138(PTD9_._I2C0_SDA_._UART5_TX_._FB_A17/NFC_ALE_.)
PTD10_2: U1.139(PTD10_._UART5_RTS#_._FB_A18/NFC_RE_.)
PTD11_2: U1.140(PTD11_._SPI2_PCS0_._UART5_CTS#_._SDHC0_CLKIN_._FB_A19_.)
PTD12_2: U1.141(PTD12_._SPI2_SCK_._FTM3_FLT0_._SDHC0_D4_._FB_A20_.)
PTD13_2: U1.142(PTD13_._SPI2_SOUT_._SDHC0_D5_._FB_A21_.)
PTD14_2: U1.143(PTD14_._SPI2_SIN_._SDHC0_D6_._FB_A22_.)
PTD15_2: U1.144(PTD15_._SPI2_PCS1_._SDHC0_D7_._FB_A23_.)
PTE2_2: U1.3(PTE2/LLWU_P1_._ADC1_SE6a_._SPI1_SCK_._UART1_CTS#_._SDHC0_DCLK_.)
PTE3_2: U1.4(PTE3_._ADC1_SE7a_._SPI1_SIN_._UART1_RTS#_._SDHC0_CMD_._SPI1_SOUT_.)
PTE4_2: U1.7(PTE4/LLWU_P2_._SPI1_PCS0_._UART3_TX_._SDHC0_D3_.)
PTE5_2: U1.8(PTE5_._SPI1_PCS2_._UART3_RX_._SDHC0_D2_._FTM3_CH0_.)
PTE6_2: U1.9(PTE6_._SPI1_PCS3_._UART3_CTS#_._I2S0_MCLK_._FTM3_CH1_._USB_SOF_OUT_.)
PTE7_2: U1.10(PTE7_._UART3_RTS#_._I2S0_RXD0_._FTM3_CH2_.)
PTE8_2: U1.11(PTE8_._ADC2_SE16_._I2S0_RXD1_._UART5_TX_._I2S0_RX_FS_._FTM3_CH3_.)
PTE9_2: U1.12(PTE9_._ADC2_SE17_._I2S0_TXD1_._UART5_RX_._I2S0_RX#CLK_._FTM3_CH4_.)
PTE10_2: U1.13(PTE10_._UART5_CTS#_._I2S0_TXD0_._FTM3_CH5_.)
PTE11_2: U1.14(PTE11_._ADC3_SE16_._UART5_RTS#_._I2S0_TX_FS_._FTM3_CH6_.)
PTE12_2: U1.15(PTE12_._ADC3_SE17_._I2S0_TX#CLK_._FTM3_CH7_.)
PTE24_2: U1.45(PTE24_._ADC0_SE17/EXTAL1_._CAN1_TX_._UART4_TX_._I2S1_TX_FS_._EWM_OUT#_._I2S1_RXD1_.)
PTE25_2: U1.46(PTE25_._ADC0_SE18/XTAL1_._CAN1_RX_._UART4_RX_._I2S1_TX#CLK_._EWM_IN_._I2S1_TXD1_.)
PTE26_2: U1.47(PTE26_._ADC3_SE5b_._ENET_1588_CLKIN_._UART4_CTS#_._I2S1_TXD0_._RTC_CLKOUT_._USB_CLKIN_.)
PTE27_2: U1.48(PTE27_._ADC3_SE4b_._UART4_RTS#_._I2S1_MCLK_.)
PTE28_2: U1.49(PTE28_._ADC3_SE7a_.)
RESET_2: C120.1 D9.3 D12.3 R67.2 U1.74(RESET#_.)
RESET_2_C: D9.1
RESET_2_U: D9.2
RESET_E_2: D12.2
SPI0_CLK: U1.110(PTC5/LLWU_P9_._SPI0_SCK_._LPTMR0_ALT2_._I2S0_RXD0_._FB_AD10/NFC_DATA7_._CMP0_OUT_._I2S1_TX_FS_.) U14.3(1B2)
SPI0_SIN: U14.12(4A)
SPI0_SOUT: U1.112(PTC7_._CMP0_IN1_._SPI0_SIN_._USB_SOF_OUT_._I2S0_RX_FS_._FB_AD8/NFC_DATA5_.) U14.6(2B2)
SPI0_SOUT_2: U1.111(PTC6/LLWU_P10_._CMP0_IN0_._SPI0_SOUT_._PDB0_EXTRG_._I2S0_RX#CLK_._FB_AD9/NFC_DATA6_._I2S0_MCLK_.) U14.13(4B2)
UART0_CTS: U1.84(PTB3_._ADC0_SE13/TSI0_CH8_._I2C0_SDA_._UART0_CTS#/UART0_COL#_._ENET0_1588_TMR1_._FTM0_FLT0_.)
UART0_CTS_2: U1.68(PTA16_._CMP3_IN2_._SPI0_SOUT_._UART0_CTS#/UART0_COL#_._RMII0_TXD0/MII0_TXD0_._I2S0_RX_FS_._I2S0_RXD1_.)
UART0_RTS: U1.83(PTB2_._ADC0_SE12/TSI0_CH7_._I2C0_SCL_._UART0_RTS#_._ENET0_1588_TMR0_._FTM0_FLT3_.)
UART0_RTS_2: U1.69(PTA17_._ADC1_SE17_._SPI0_SIN_._UART0_RTS#_._RMII0_TXD1/MII0_TXD1_._I2S0_MCLK_.)
UART0_RX: U1.133(PTD6/LLWU_P15_._ADC0_SE7b_._SPI0_PCS3_._UART0_RX_._FTM0_CH6_._FB_AD0_._FTM0_FLT0_.)
UART0_RX_2: U1.67(PTA15_._CMP3_IN1_._SPI0_SCK_._UART0_RX_._RMII0_TXEN/MII0_TXEN_._I2S0_RXD0_.)
UART0_TX: U1.136(PTD7_._CMT_IRO_._UART0_TX_._FTM0_CH7_._FTM0_FLT1_.)
UART0_TX_2: U1.66(PTA14_._CMP3_IN0_._SPI0_PCS0_._UART0_TX_._RMII0_CRS_DV/MII0_RXDV_._I2S0_RX#CLK_._I2S0_TXD1_.)
UART1_RX: U1.1(PTE0_._ADC1_SE4a_._SPI1_PCS1_._UART1_TX_._SDHC0_D1_._I2C1_SDA_._RTC_CLKOUT_.)
UART1_TX: U1.2(PTE1/LLWU_P0_._ADC1_SE5a_._SPI1_SOUT_._UART1_RX_._SDHC0_D0_._I2C1_SCL_._SPI1_SIN_.)
USB0_2_N: U1.20(USB0_DM_.)
USB0_2_P: U1.19(USB0_DP_.)
USB_EZP_CS_2: U14.11(3B1)
VREGIN_2: R60.2 U1.22(VREGIN_.)
XTAL_2: C110.1 R58.1 U1.73(PTA19_._XTAL0_._FTM1_FLT0_._FTM_CLKIN1_._LPTMR0_ALT1_.) Z5.1
NetC111_1: C111.1 R59.2 U1.21(VOUT33_.)
NetC114_1: C114.1 C115.2 L14.2 U1.33(VREFL_.)
NetC114_2: C114.2 C115.1 L13.2 U1.32(VREFH_.)
NetC116_1: C116.1 U1.37(VREF_OUT/CMP1_IN5/CMP0_IN5/ADC1_SE18_.)
NetC117_1: C117.1 U1.40(XTAL32_.) Z6.1
NetC118_1: C118.1 U1.41(EXTAL32_.) Z6.2
NetD12_1: D12.1 X7.8(RESET)
NetU1_50: U1.50(PTA0_._TSI0_CH1_._UART0_CTS#_._FTM0_CH5_._JTAG_TCLK/SWD_CLK_._EZP_CLK) U14.4(1A)
NetU1_51: U1.51(PTA1_._TSI0_CH2_._UART0_RX_._FTM0_CH6_._JTAG_TDI_._EZP_DI) U14.7(2A)
NetU1_54: U1.54(PTA4/LLWU_P3_._TSI0_CH5_._FTM0_CH1_._NMI#_._EZP_CS#) U14.9(3A)

Not connected (* = marked no-connect by the designer): X7 2(TRST)

### Layout directives
net class ANALOG2: DAC0_OUT_2, DAC1_OUT_2
net class IPC_SPI: SPI0_SOUT_2
differential pair: USB0_2_N, USB0_2_P

### Notes on the sheet
- Inter-proc. UART bus
- Inter-proc. SPI bus
- HOST UART
- (in symbol SN74CBTLV3257DBQR) 0: A = B1; 1: A = B2

### Library data of the parts
C109 C110 = CCPF010K0603: 10 pF, 50V, 5%, NP0, 0603 SMD MLC Capacitor; Manufacturer: Kemet; PartNum: 399-1049-1-ND; PartName: C0603C100J5GACTU; Tolerance: 5%; Price: 0.0075$; Distributor: Digi-Key; Voltage: 50 V
C111 = C2012X5R1C106K/0.85: 10 uF, 16V, X5R, ±10%, 0805; Manufacturer: TDK Corporation; Distributor: Future; Price: 0.0347 Euro; Tolerance: ±10%; PartNum: C2012X5R1C106K085AC; Voltage: 16V; PartName: C2012X5R1C106K085AC; Price50: 0.0347 Euro; Price100: 0.0347 Euro; Price1000: 0.0347 Euro
C112 C114 C119 C120 C166-C174 = GRM155R71C104KA88D: 0.1 uF, 16V, 10%, X7R, 0402; Manufacturer: Murata; PartNum: 490-3261-1-ND; Tolerance: 10%; Distributor: Digi-Key; Price: 0.005$; Voltage: 16 V
C113 C115 = GRM155R71C103KA01D_1: 10 nF, 16V, 10%, X7R, 0402; Manufacturer: SAMSUNG; Tolerance: 10%; Distributor: Future; Price: 0.02$; PartNum: CL05B103KB5NNNC; Voltage: 16 V; PartName: CL05B103KB5NNNC
C116 = CVNF100K0603-25: 0.1 uF, 25V, 10% , X7R,  0603 SMD MLC Capacitor; Manufacturer: SAMSUNG; Tolerance: 10%; Distributor: Future; Price: 0.0026 Euro; Voltage: 25 V; PartNum: CL10B104KA8NNND; PartName: CL10B104KA8NNND; Price50: 0.0026 Euro; Price100: 0.0026 Euro; Price1000: 0.0026 Euro
C117 C118 = CCPF015K0603: 15 pF, 50V, 5%, NP0, 0603 SMD MLC Capacitor; Manufacturer: YAGEO AMERICA CORPORATION; Tolerance: 5%; Price: 0.003$; Distributor: Future; PartNum: CC0603JRNPO9BN150; Voltage: 50 V; PartName: CC0603JRNPO9BN150; Price50: 0.003$; Price100: 0.003$; Price1000: 0.003$
D9 D12 = BAT54AT-TP: Schottky Diode, 30 V, 200 mA, common anode, SOT523; Manufacturer: Micro Commercial Co; PartNum: BAT54AT-TPDKR-ND; Distributor: Digi-Key; Price: 0.52$; PartName: BAT54AT-TP
L12-L15 = MPZ1005S121C: Ferrite bead, 120 Ohm, 100 MHz,  1.2 A, 0.09 Ohm, 0402; Manufacturer: TDK Corporation; PartNum: 445-2981-1-ND; Distributor: Digi-Key; Price: 0.1$; PartName: MPZ1005S121C
R58 = RC0603FR-071ML: 1 M, 1%, 0603, SMD Resistor, Taped; Manufacturer: YAGEO AMERICA CORPORATION; Voltage: 75 V; Distributor: Future; Price: 0.002 Euro; Tolerance: 1%; PartNum: RC0603FR-071ML; PartName: RC0603FR-071ML
R59 R60 = DNP_0603: DNP, 0603
R61-R64 R66 R67 = RC0402JR-0710KL: 10 K, 5%, 0402, SMD Resistor, Taped; Manufacturer: Yageo; PartNum: 311-10KJRCT-ND; Voltage: 75 V; Distributor: Digi-Key; Price: 0.1$; Tolerance: 5%; PartName: RC0402JR-0710KL
U1 = MK60FN1M0VLQ12: MK60 Series 32 Bit 1 MB Flash 128 KB Ram 120 Mhz Microcontroller - LQFP-144; Manufacturer: Freescale; Distributor: Future; PartNum: MK60FN1M0VLQ12; Price: 8.45 Euro
U14 = SN74CBTLV3257DBQR: LV DUAL FET MUX/DEMUX, 2.3..3.6V,  -40..85 C, 16SSOP; Manufacturer: Texas Instruments; PartNum: 296-9135-1-ND; Price: 0.95$; Distributor: Digi-Key; PartName: SN74CBTLV3257DBQR
X7 = 0878321020: JTAG, CONN HEADER 10POS 2MM VERT SMD; Manufacturer: Molex Inc; PartNum: WM18639-ND; Distributor: Digi-Key; Price: 1.29$; PartName: 0878321020
Z5 = NX3225SA-12.000MHZ-STD-CSR-1: 12 MHz, 8 pF, ±15ppm, -10...+75 С; Manufacturer: NDK; PartNum: 644-1047-1-ND; Price: 1$; Distributor: Digi-Key; Tolerance: 15 ppm; PartName: NX3225SA-12.000MHZ-STD-CSR-1
Z6 = ABS10-32.768KHZ-T: 32.768 kHz, 12.5 pF, 70 kOhm, ±20ppm, -40°C ~ 80°C; Manufacturer: Abracon Corporation; PartNum: 535-9536-1-ND; Price: 0.82$; Tolerance: 20 ppm; Distributor: Digi-Key; PartName: ABS10-32.768KHZ-T

## Sheet Sheet5.SchDoc
size A3; DocumentNumber: 5; SheetNumber: 5; SheetTotal: 7
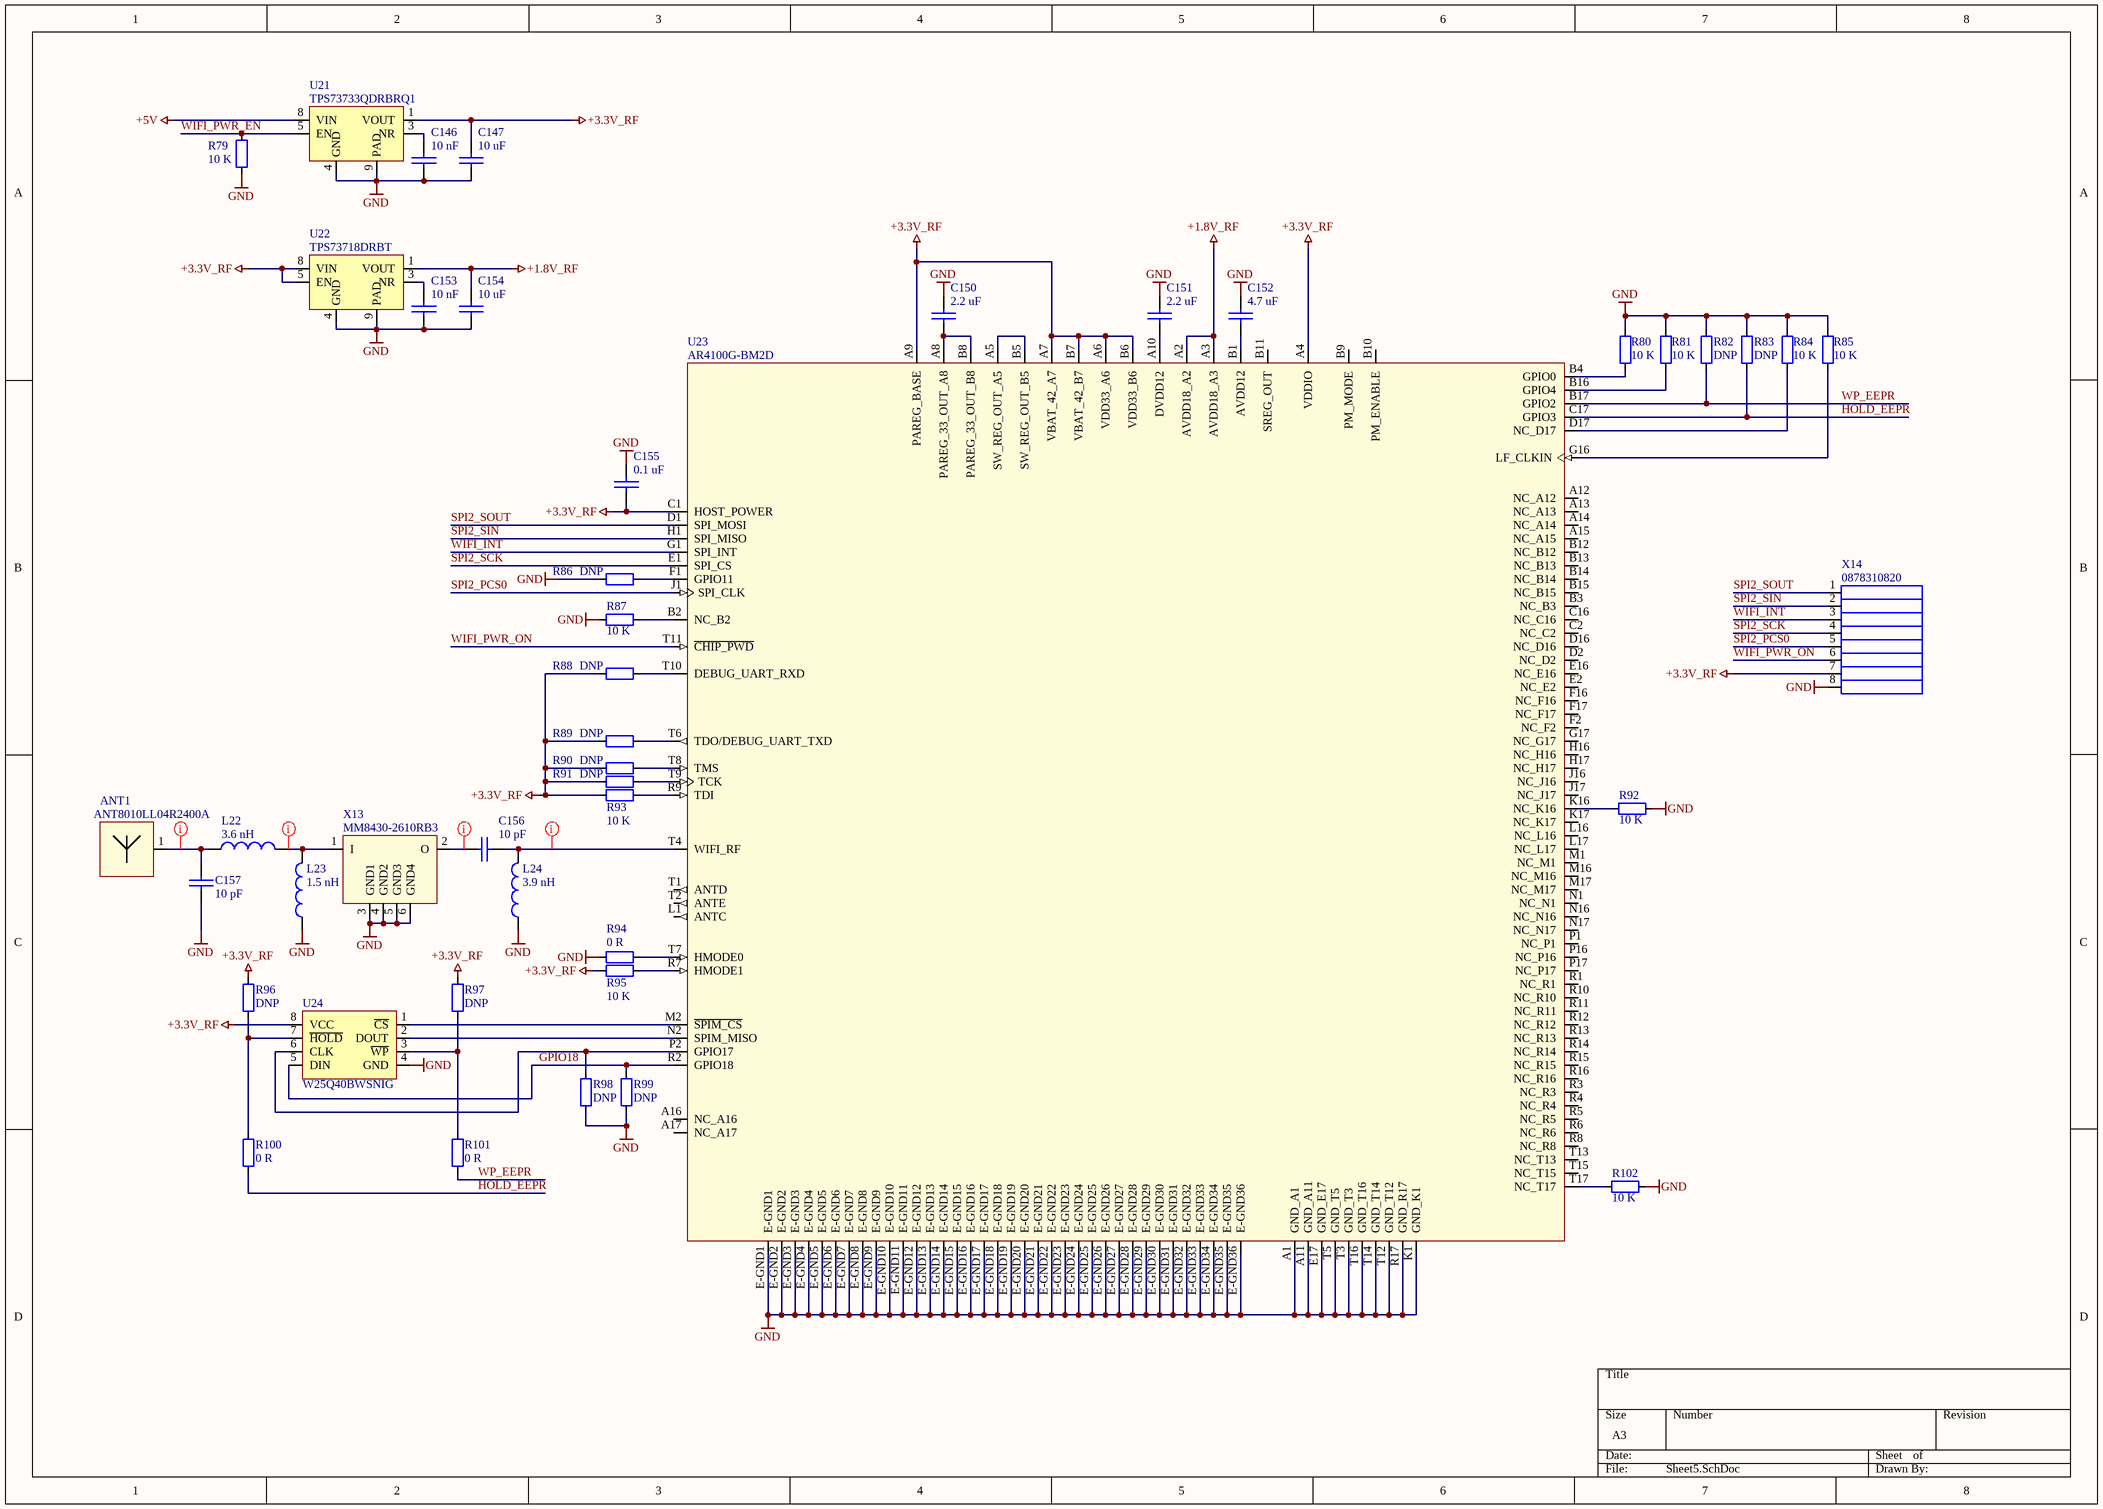
[diagram p4: Sheet5.SchDoc]

### Parts
ANT1  ANT8010LL04R2400A  [ANT8010LL04R2400A]
C146  value 10 nF  [1005[0402]]  (hidden comment: CL05B103KB5NNNC)
C147  value 10 uF  [2012[0805]]  (hidden comment: C2012X5R1C106K085AC)
C150  value 2.2 uF  [1005[0402]]  (hidden comment: C0402C225M9PACTU)
C151  value 2.2 uF  [1005[0402]]  (hidden comment: C0402C225M9PACTU)
C152  value 4.7 uF  [1608[0603]]  (hidden comment: LMK107BJ475KA-T)
C153  value 10 nF  [1005[0402]]  (hidden comment: CL05B103KB5NNNC)
C154  value 10 uF  [2012[0805]]  (hidden comment: CL05B104KO5NNNC)
C155  value 0.1 uF  [1005[0402]]  (hidden comment: CL05B104KO5NNNC)
C156  value 10 pF  [1005[0402]]  (hidden comment: GRM1555C1H100JZ01D)
C157  value 10 pF  [1005[0402]]  (hidden comment: GRM1555C1H100JZ01D)
L22  value 3.6 nH  [INDC1005-0402]  (hidden comment: LQP15MN3N6B02D)
L23  value 1.5 nH  [INDC1005-0402]  (hidden comment: LQP15MN1N5B02D)
L24  value 3.9 nH  [INDC1005-0402]  (hidden comment: LQP15MN3N9B02D)
R79  value 10 K  [0603]  (hidden comment: ERJ-3EKF1002V)
R80  value 10 K  [0402]  (hidden comment: ERJ-3EKF1002V)
R81  value 10 K  [0402]  (hidden comment: ERJ-3EKF1002V)
R82  value DNP  [0603]  (hidden comment: DNP_0603)  (no BOM)
R83  value DNP  [0603]  (hidden comment: DNP_0603)  (no BOM)
R84  value 10 K  [0402]  (hidden comment: ERJ-3EKF1002V)
R85  value 10 K  [0402]  (hidden comment: ERJ-3EKF1002V)
R86  value DNP  [0603]  (hidden comment: DNP_0603)  (no BOM)
R87  value 10 K  [0402]  (hidden comment: ERJ-3EKF1002V)
R88  value DNP  [0603]  (hidden comment: DNP_0603)  (no BOM)
R89  value DNP  [0603]  (hidden comment: DNP_0603)  (no BOM)
R90  value DNP  [0603]  (hidden comment: DNP_0603)  (no BOM)
R91  value DNP  [0603]  (hidden comment: DNP_0603)  (no BOM)
R92  value 10 K  [0402]  (hidden comment: ERJ-3EKF1002V)
R93  value 10 K  [0402]  (hidden comment: ERJ-3EKF1002V)
R94  value 0 R  [0603]  (hidden comment: RC0603JR-070RL)
R95  value 10 K  [0402]  (hidden comment: ERJ-3EKF1002V)
R96  value DNP  [0603]  (hidden comment: DNP_0603)  (no BOM)
R97  value DNP  [0603]  (hidden comment: DNP_0603)  (no BOM)
R98  value DNP  [0603]  (hidden comment: DNP_0603)  (no BOM)
R99  value DNP  [0603]  (hidden comment: DNP_0603)  (no BOM)
R100  value 0 R  [0603]  (hidden comment: RC0603JR-070RL)
R101  value 0 R  [0603]  (hidden comment: RC0603JR-070RL)
R102  value 10 K  [0402]  (hidden comment: ERJ-3EKF1002V)
U21  TPS73733QDRBRQ1  [TI DRB (S-PVSON-N8)]
U22  TPS73718DRBT  [TI DRB (S-PVSON-N8)]
U23  AR4100G-BM2D  [AR4100 BGA147]
U24  W25Q40BWSNIG  [SO-8]
X13  MM8430-2610RB3  [MM8430-2610RB3]
X14  0878310820  [0878310820 MGRID WALL HDR SMD]

### Nets
+1.8V_RF: C154.1 U22.1(VOUT) U23.A2(AVDD18_A2) U23.A3(AVDD18_A3)
+3.3V_RF: C147.2 C155.2 R88.2 R89.2 R90.2 R91.2 R93.2 R95.2 R96.2 R97.2 U21.1(VOUT) U22.5(EN) U22.8(VIN) U23.A4(VDDIO) U23.A6(VDD33_A6) U23.A7(VBAT_42_A7) U23.A9(PAREG_BASE) U23.B6(VDD33_B6) U23.B7(VBAT_42_B7) U23.C1(HOST_POWER) U24.8(VCC) X14.7
+5V: U21.8(VIN)
GND: C146.2 C147.1 C150.1 C151.1 C152.1 C153.2 C154.2 C155.1 C157.1 L23.1 L24.1 R79.2 R80.2 R81.2 R82.2 R83.2 R84.2 R85.2 R86.2 R87.2 R92.1 R94.2 R98.1 R99.1 R102.1 U21.4(GND) U21.9(PAD) U22.4(GND) U22.9(PAD) U23.A1(GND_A1) U23.A11(GND_A11) U23.E17(GND_E17) U23.E-GND1 U23.E-GND2 U23.E-GND3 U23.E-GND4 U23.E-GND5 U23.E-GND6 U23.E-GND7 U23.E-GND8 U23.E-GND9 U23.E-GND10 U23.E-GND11 U23.E-GND12 U23.E-GND13 U23.E-GND14 U23.E-GND15 U23.E-GND16 U23.E-GND17 U23.E-GND18 U23.E-GND19 U23.E-GND20 U23.E-GND21 U23.E-GND22 U23.E-GND23 U23.E-GND24 U23.E-GND25 U23.E-GND26 U23.E-GND27 U23.E-GND28 U23.E-GND29 U23.E-GND30 U23.E-GND31 U23.E-GND32 U23.E-GND33 U23.E-GND34 U23.E-GND35 U23.E-GND36 U23.K1(GND_K1) U23.R17(GND_R17) U23.T3(GND_T3) U23.T5(GND_T5) U23.T12(GND_T12) U23.T14(GND_T14) U23.T16(GND_T16) U24.4(GND) X13.3(GND1) X13.4(GND2) X13.5(GND3) X13.6(GND4) X14.8
GPIO18: R99.2 U23.R2(GPIO18) U24.5(DIN)
HOLD_EEPR: R83.1 R100.2 U23.C17(GPIO3)
SPI2_PCS0: U23.J1(SPI_CLK) X14.5
SPI2_SCK: U23.E1(SPI_CS) X14.4
SPI2_SIN: U23.H1(SPI_MISO) X14.2
SPI2_SOUT: U23.D1(SPI_MOSI) X14.1
WIFI_INT: U23.G1(SPI_INT) X14.3
WIFI_PWR_EN: R79.1 U21.5(EN)
WIFI_PWR_ON: U23.T11(~{CHIP_PWD}) X14.6
WP_EEPR: R82.1 R101.2 U23.B17(GPIO2)
NetANT1_1: ANT1.1(INPUT) C157.2 L22.1
NetC146_1: C146.1 U21.3(NR)
NetC150_2: C150.2 U23.A8(PAREG_33_OUT_A8) U23.B8(PAREG_33_OUT_B8)
NetC151_2: C151.2 U23.A10(DVDD12)
NetC152_2: C152.2 U23.B1(AVDD12)
NetC153_1: C153.1 U22.3(NR)
NetC156_1: C156.1 X13.2(O)
NetC156_2: C156.2 L24.2 U23.T4(WIFI_RF)
NetL22_2: L22.2 L23.2 X13.1(I)
NetR80_1: R80.1 U23.B4(GPIO0)
NetR81_1: R81.1 U23.B16(GPIO4)
NetR84_1: R84.1 U23.D17(NC_D17)
NetR85_1: R85.1 U23.G16(LF_CLKIN)
NetR86_1: R86.1 U23.F1(GPIO11)
NetR87_1: R87.1 U23.B2(NC_B2)
NetR88_1: R88.1 U23.T10(DEBUG_UART_RXD)
NetR89_1: R89.1 U23.T6(TDO/DEBUG_UART_TXD)
NetR90_1: R90.1 U23.T8(TMS)
NetR91_1: R91.1 U23.T9(TCK)
NetR92_2: R92.2 U23.K16(NC_K16)
NetR93_1: R93.1 U23.R9(TDI)
NetR94_1: R94.1 U23.T7(HMODE0)
NetR95_1: R95.1 U23.R7(HMODE1)
NetR96_1: R96.1 R100.1 U24.7(~{HOLD})
NetR97_1: R97.1 R101.1 U24.3(~{WP})
NetR98_2: R98.2 U23.P2(GPIO17) U24.6(CLK)
NetR102_2: R102.2 U23.T17(NC_T17)
NetU23_A5: U23.A5(SW_REG_OUT_A5) U23.B5(SW_REG_OUT_B5)
NetU23_M2: U23.M2(~{SPIM_CS}) U24.1(~{CS})
NetU23_N2: U23.N2(SPIM_MISO) U24.2(DOUT)

Not connected (* = marked no-connect by the designer): U23 A12(NC_A12) A13(NC_A13) A14(NC_A14) A15(NC_A15) A16(NC_A16) A17(NC_A17) B3(NC_B3) B9(PM_MODE) B10(PM_ENABLE) B11(SREG_OUT) B12(NC_B12) B13(NC_B13) B14(NC_B14) B15(NC_B15) C2(NC_C2) C16(NC_C16) D2(NC_D2) D16(NC_D16) E2(NC_E2) E16(NC_E16) F2(NC_F2) F16(NC_F16) F17(NC_F17) G17(NC_G17) H16(NC_H16) H17(NC_H17) J16(NC_J16) J17(NC_J17) K17(NC_K17) L1(ANTC) L16(NC_L16) L17(NC_L17) M1(NC_M1) M16(NC_M16) M17(NC_M17) N1(NC_N1) N16(NC_N16) N17(NC_N17) P1(NC_P1) P16(NC_P16) P17(NC_P17) R1(NC_R1) R3(NC_R3) R4(NC_R4) R5(NC_R5) R6(NC_R6) R8(NC_R8) R10(NC_R10) R11(NC_R11) R12(NC_R12) R13(NC_R13) R14(NC_R14) R15(NC_R15) R16(NC_R16) T1(ANTD) T2(ANTE) T13(NC_T13) T15(NC_T15)

### Layout directives
net class WIFI_ANT: NetANT1_1, NetC156_1, NetC156_2, NetL22_2

### Library data of the parts
ANT1 = ANT8010LL04R2400A: Chip ant. 2.4GHz ~ 2.5GHz, 5.5dBi; Manufacturer: Yageo; PartNum: 311-1550-1-ND; Distributor: Digi-Key; PartName: ANT8010LL04R2400A; Price: 1$
C146 C153 = GRM155R71C103KA01D_1: as C113 on sheet Sheet4; Tolerance: 10%; Distributor: Future; Price: 0.02$; PartNum: CL05B103KB5NNNC; Voltage: 16 V; PartName: CL05B103KB5NNNC
C147 = C2012X5R1C106K/0.85: as C111 on sheet Sheet4; Distributor: Future; Price: 0.0347 Euro; Tolerance: ±10%; PartNum: C2012X5R1C106K085AC; Voltage: 16V; PartName: C2012X5R1C106K085AC; Price50: 0.0347 Euro; Price100: 0.0347 Euro; Price1000: 0.0347 Euro
C150 C151 = C0402C225M9PACTU: 2.2 uF, 6.3V, 20%, X5R, -55..85C, 0402; Manufacturer: SAMSUNG; PartNum: 399-7781-1-ND; Tolerance: 20%; Distributor: Future; Price: 0.22$; Voltage: 6.3 V; PartName: C0402C225M9PACTU
C152 = LMK107BJ475KA-T: 4.7 uF, 10V, 10%, X5R, 0603; Manufacturer: Taiyo Yuden; PartNum: 587-1441-1-ND; Tolerance: +-10%; Distributor: Digi-Key; Price: 0.23$; PartName: LMK107BJ475KA-T; Voltage: 10 V
C154 = C2012X5R1C106K/0.85: 10 uF, 16V, X5R, ±10%, 0805; Manufacturer: TDK Corporation; PartNum: 445-7644-1-ND; Tolerance: ±10%; Distributor: Digi-Key; Price: 0.15$; Voltage: 16V; PartName: C2012X5R1C106K/0.85
C155 = GRM155R71C104KA88D_1: 0.1 uF, 16V, 10%, X7R, 0402; Manufacturer: SAMSUNG; Tolerance: 10%; Distributor: Future; Price: 0.02$; PartNum: CL05B104KO5NNNC; Voltage: 16 V; PartName: CL05B104KO5NNNC
C156 C157 = GRM1555C1H100JZ01D: 10 pF, 50V, 5%, NP0/COG, 0402; Manufacturer: Murata; Tolerance: 5%; Price: 0.01$; Distributor: Mouser
L22 = LQP15MN3N6B02D: 3.6 nH, ±0.1nH, 170 мА, 0402; Manufacturer: Murata; PartNum: 490-6756-1-ND; Tolerance: ±0.1nH; Price: 0.18$; Distributor: Digi-Key; PartName: LQP15MN3N6B02D
L23 = LQP15MN1N5B02D: 1.5 nH, ±0.1nH, 280 мА, 0402; Manufacturer: Murata; PartNum: 490-1126-1-ND; Tolerance: ±0.1nH; Price: 0.18$; Distributor: Digi-Key; PartName: LQP15MN1N5B02D
L24 = LQP15MN3N9B02D: 3.9 nH, ±0.1nH, 170 мА, 0402; Manufacturer: Murata; PartNum: 490-1131-1-ND; Tolerance: ±0.1nH; Price: 0.18$; Distributor: Digi-Key; PartName: LQP15MN3N9B02D
R79 = RL0603K010-1: 10 K, 1%, 0603, SMD Resistor, Taped; Manufacturer: PANASONIC; Voltage: 75 V; Distributor: Future; Price: 0.0015 Euro; Tolerance: 1%; PartNum: ERJ-3EKF1002V; PartName: ERJ-3EKF1002V; Price50: 0.0015 Euro; Price100: 0.0015 Euro; Price1000: 0.0015 Euro
R80 R81 R84 R85 R87 R92 R93 R95 R102 = RC0402JR-0710KL: as R61-R64 on sheet Sheet4; Distributor: Digi-Key; Price: 0.1$; Tolerance: 5%; PartName: RC0402JR-0710KL
R82 R83 R86 R88-R91 R96-R99 = DNP_0603: DNP, 0603
R94 R100 R101 = RL0603E000: 0 R, 5%, 0603, SMD Resistor, Taped; Manufacturer: YAGEO AMERICA CORPORATION; Voltage: 75 V; Distributor: Future; Price: 0.0017$; Tolerance: 5%; PartNum: RC0603JR-070RL; PartName: RC0603JR-070RL; Price50: 0.0017$; Price100: 0.0017$; Price1000: 0.0017$
U21 = TPS73733QDRBRQ1: LDO 3.3V 1A , up to 5.5 V, -40..125C,  8-SON; Manufacturer: Texas Instruments; PartNum: 296-24157-1-ND; Price: 2$; Distributor: Digi-Key; PartName: TPS73733QDRBRQ1
U22 = TPS73718DRBT: LDO 1.8V 1A , 2.2..5.5 V, -40..125C,  8-SON; Manufacturer: Texas Instruments; PartNum: 296-28932-1-ND; Price: 2$; Distributor: Digi-Key; PartName: TPS73718DRBT
U23 = AR4100G-BM2D: Atheros single-stream 802.11n system-in-package Wi-Fi-System; Manufacturer: Qualcomm; Distributor: Future; PartName: AR4100G-BM2D; PartNum: AR4100G-BM2D; Price: 8.6$
U24 = W25Q40BWSNIG: FLASH 4MBIT 80MHZ,  1.65..1.95V, -40..85C, 8SOIC; Manufacturer: Winbond Electronics; PartNum: W25Q40BWSNIG-ND; Price: 0.63$; Distributor: Digi-Key; PartName: W25Q40BWSNIG
X13 = MM8430-2610RB3: ONN SWD JACK STR 50 OHM SMD; Manufacturer: Murata Electronics North America; PartNum: 490-8451-6-ND; Distributor: Digi-Key; PartName: MM8430-2610RB3; Price: 1.15$
X14 = 0878310820: CONN HEADER 8POS 2MM VERT GOLD; Manufacturer: Molex Inc; PartNum: WM18559-ND; Distributor: Digi-Key; Price: 0.85$; PartName: 0878310820